# Altium project MiniPC.PrjPcb (part 3 of 17)

## Sheet DDR4_Arria10.SchDoc: DDR4
size B; DocumentNumber: 19; SheetNumber: 19; SheetTotal: 46
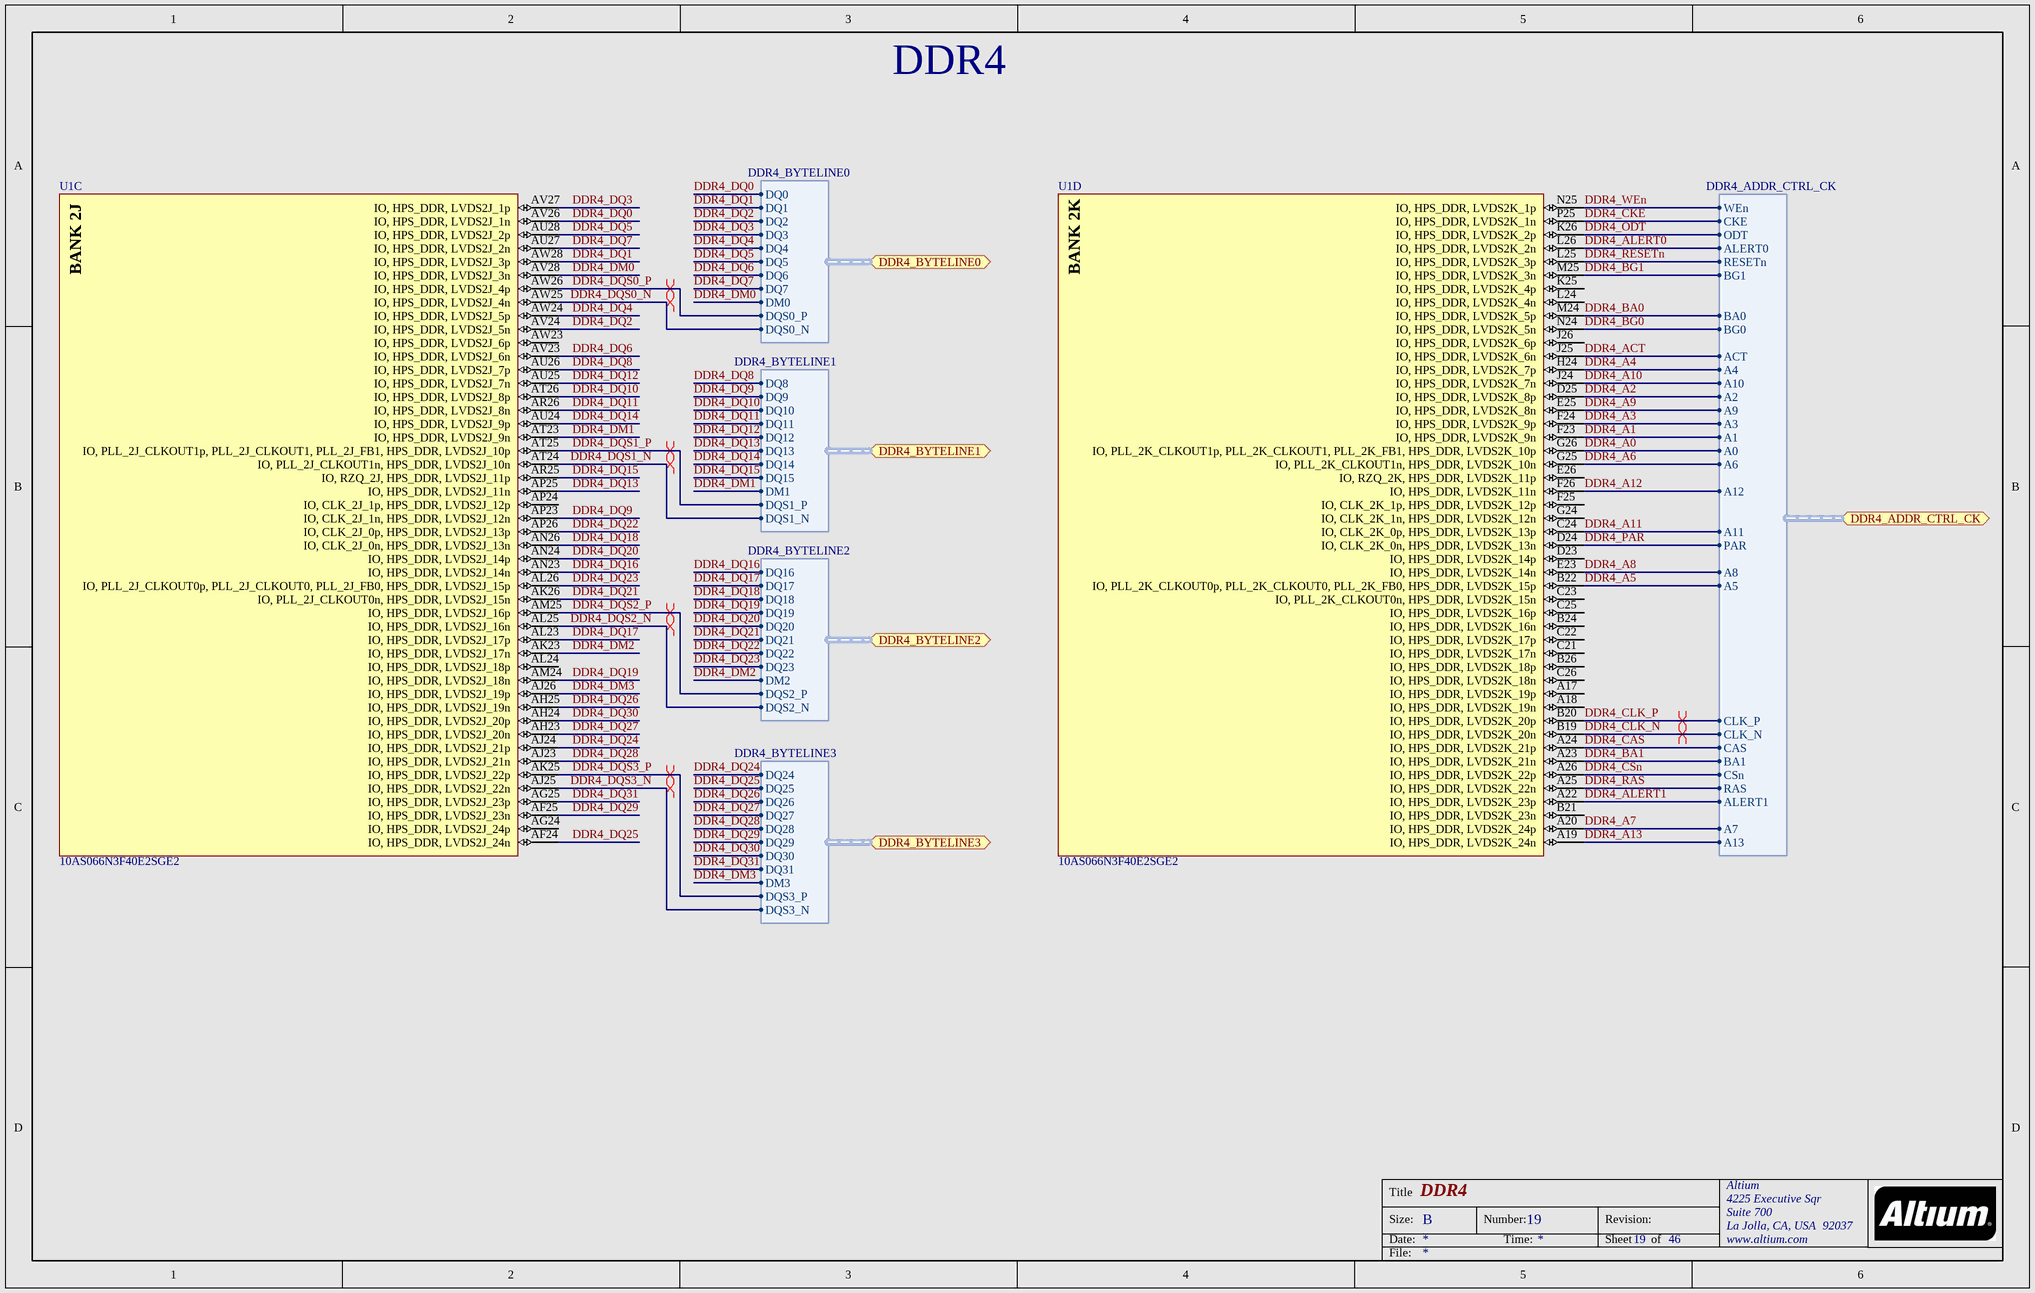
[diagram p9: DDR4_Arria10.SchDoc]

### Parts
U1  10AS066N3F40E2SGE2  [ALTR-FBGA1517_A-350]  (parts C,D of 31)

### Ports
DDR4_ADDR_CTRL_CK (harness DDR4_ADDR_CTRL_CK), DDR4_BYTELINE0 (harness DDR4_BYTELINE0), DDR4_BYTELINE1 (harness DDR4_BYTELINE1), DDR4_BYTELINE2 (harness DDR4_BYTELINE2), DDR4_BYTELINE3 (harness DDR4_BYTELINE3)

### Harnesses
DDR4_BYTELINE0: DQ0, DQ1, DQ2, DQ3, DQ4, DQ5, DQ6, DQ7, DM0, DQS0_P, DQS0_N
DDR4_BYTELINE1: DQ8, DQ9, DQ10, DQ11, DQ12, DQ13, DQ14, DQ15, DM1, DQS1_P, DQS1_N
DDR4_BYTELINE2: DQ16, DQ17, DQ18, DQ19, DQ20, DQ21, DQ22, DQ23, DM2, DQS2_P, DQS2_N
DDR4_BYTELINE3: DQ24, DQ25, DQ26, DQ27, DQ28, DQ29, DQ30, DQ31, DM3, DQS3_P, DQS3_N
DDR4_ADDR_CTRL_CK: A0, A1, A2, A3, A4, A5, A6, A7, A8, A9, A10, A11, A12, A13, BA0, BA1, BG0, CLK_P, CLK_N, CKE, WEn, CAS, RAS, CSn, PAR, ACT, ODT, ALERT0, RESETn, BG1, ALERT1

### Nets
DDR4_A0: U1.G26(IO,_PLL_2K_CLKOUT1p,_PLL_2K_CLKOUT1,_PLL_2K_FB1,_HPS_DDR,_LVDS2K_10p) ; port DDR4_ADDR_CTRL_CK.A0
DDR4_A1: U1.F23(IO,_HPS_DDR,_LVDS2K_9n) ; port DDR4_ADDR_CTRL_CK.A1
DDR4_A2: U1.D25(IO,_HPS_DDR,_LVDS2K_8p) ; port DDR4_ADDR_CTRL_CK.A2
DDR4_A3: U1.F24(IO,_HPS_DDR,_LVDS2K_9p) ; port DDR4_ADDR_CTRL_CK.A3
DDR4_A4: U1.H24(IO,_HPS_DDR,_LVDS2K_7p) ; port DDR4_ADDR_CTRL_CK.A4
DDR4_A5: U1.B22(IO,_PLL_2K_CLKOUT0p,_PLL_2K_CLKOUT0,_PLL_2K_FB0,_HPS_DDR,_LVDS2K_15p) ; port DDR4_ADDR_CTRL_CK.A5
DDR4_A6: U1.G25(IO,_PLL_2K_CLKOUT1n,_HPS_DDR,_LVDS2K_10n) ; port DDR4_ADDR_CTRL_CK.A6
DDR4_A7: U1.A20(IO,_HPS_DDR,_LVDS2K_24p) ; port DDR4_ADDR_CTRL_CK.A7
DDR4_A8: U1.E23(IO,_HPS_DDR,_LVDS2K_14n) ; port DDR4_ADDR_CTRL_CK.A8
DDR4_A9: U1.E25(IO,_HPS_DDR,_LVDS2K_8n) ; port DDR4_ADDR_CTRL_CK.A9
DDR4_A10: U1.J24(IO,_HPS_DDR,_LVDS2K_7n) ; port DDR4_ADDR_CTRL_CK.A10
DDR4_A11: U1.C24(IO,_CLK_2K_0p,_HPS_DDR,_LVDS2K_13p) ; port DDR4_ADDR_CTRL_CK.A11
DDR4_A12: U1.F26(IO,_HPS_DDR,_LVDS2K_11n) ; port DDR4_ADDR_CTRL_CK.A12
DDR4_A13: U1.A19(IO,_HPS_DDR,_LVDS2K_24n) ; port DDR4_ADDR_CTRL_CK.A13
DDR4_ACT: U1.J25(IO,_HPS_DDR,_LVDS2K_6n) ; port DDR4_ADDR_CTRL_CK.ACT
DDR4_ALERT0: U1.L26(IO,_HPS_DDR,_LVDS2K_2n) ; port DDR4_ADDR_CTRL_CK.ALERT0
DDR4_ALERT1: U1.A22(IO,_HPS_DDR,_LVDS2K_23p) ; port DDR4_ADDR_CTRL_CK.ALERT1
DDR4_BA0: U1.M24(IO,_HPS_DDR,_LVDS2K_5p) ; port DDR4_ADDR_CTRL_CK.BA0
DDR4_BA1: U1.A23(IO,_HPS_DDR,_LVDS2K_21n) ; port DDR4_ADDR_CTRL_CK.BA1
DDR4_BG0: U1.N24(IO,_HPS_DDR,_LVDS2K_5n) ; port DDR4_ADDR_CTRL_CK.BG0
DDR4_BG1: U1.M25(IO,_HPS_DDR,_LVDS2K_3n) ; port DDR4_ADDR_CTRL_CK.BG1
DDR4_CAS: U1.A24(IO,_HPS_DDR,_LVDS2K_21p) ; port DDR4_ADDR_CTRL_CK.CAS
DDR4_CKE: U1.P25(IO,_HPS_DDR,_LVDS2K_1n) ; port DDR4_ADDR_CTRL_CK.CKE
DDR4_CLK_N: U1.B19(IO,_HPS_DDR,_LVDS2K_20n) ; port DDR4_ADDR_CTRL_CK.CLK_N
DDR4_CLK_P: U1.B20(IO,_HPS_DDR,_LVDS2K_20p) ; port DDR4_ADDR_CTRL_CK.CLK_P
DDR4_CSn: U1.A26(IO,_HPS_DDR,_LVDS2K_22p) ; port DDR4_ADDR_CTRL_CK.CSn
DDR4_DM0: U1.AV28(IO,_HPS_DDR,_LVDS2J_3n) ; port DDR4_BYTELINE0.DM0
DDR4_DM1: U1.AT23(IO,_HPS_DDR,_LVDS2J_9n) ; port DDR4_BYTELINE1.DM1
DDR4_DM2: U1.AK23(IO,_HPS_DDR,_LVDS2J_17n) ; port DDR4_BYTELINE2.DM2
DDR4_DM3: U1.AJ26(IO,_HPS_DDR,_LVDS2J_19p) ; port DDR4_BYTELINE3.DM3
DDR4_DQ0: U1.AV26(IO,_HPS_DDR,_LVDS2J_1n) ; port DDR4_BYTELINE0.DQ0
DDR4_DQ1: U1.AW28(IO,_HPS_DDR,_LVDS2J_3p) ; port DDR4_BYTELINE0.DQ1
DDR4_DQ2: U1.AV24(IO,_HPS_DDR,_LVDS2J_5n) ; port DDR4_BYTELINE0.DQ2
DDR4_DQ3: U1.AV27(IO,_HPS_DDR,_LVDS2J_1p) ; port DDR4_BYTELINE0.DQ3
DDR4_DQ4: U1.AW24(IO,_HPS_DDR,_LVDS2J_5p) ; port DDR4_BYTELINE0.DQ4
DDR4_DQ5: U1.AU28(IO,_HPS_DDR,_LVDS2J_2p) ; port DDR4_BYTELINE0.DQ5
DDR4_DQ6: U1.AV23(IO,_HPS_DDR,_LVDS2J_6n) ; port DDR4_BYTELINE0.DQ6
DDR4_DQ7: U1.AU27(IO,_HPS_DDR,_LVDS2J_2n) ; port DDR4_BYTELINE0.DQ7
DDR4_DQ8: U1.AU26(IO,_HPS_DDR,_LVDS2J_7p) ; port DDR4_BYTELINE1.DQ8
DDR4_DQ9: U1.AP23(IO,_CLK_2J_1n,_HPS_DDR,_LVDS2J_12n) ; port DDR4_BYTELINE1.DQ9
DDR4_DQ10: U1.AT26(IO,_HPS_DDR,_LVDS2J_8p) ; port DDR4_BYTELINE1.DQ10
DDR4_DQ11: U1.AR26(IO,_HPS_DDR,_LVDS2J_8n) ; port DDR4_BYTELINE1.DQ11
DDR4_DQ12: U1.AU25(IO,_HPS_DDR,_LVDS2J_7n) ; port DDR4_BYTELINE1.DQ12
DDR4_DQ13: U1.AP25(IO,_HPS_DDR,_LVDS2J_11n) ; port DDR4_BYTELINE1.DQ13
DDR4_DQ14: U1.AU24(IO,_HPS_DDR,_LVDS2J_9p) ; port DDR4_BYTELINE1.DQ14
DDR4_DQ15: U1.AR25(IO,_RZQ_2J,_HPS_DDR,_LVDS2J_11p) ; port DDR4_BYTELINE1.DQ15
DDR4_DQ16: U1.AN23(IO,_HPS_DDR,_LVDS2J_14n) ; port DDR4_BYTELINE2.DQ16
DDR4_DQ17: U1.AL23(IO,_HPS_DDR,_LVDS2J_17p) ; port DDR4_BYTELINE2.DQ17
DDR4_DQ18: U1.AN26(IO,_CLK_2J_0n,_HPS_DDR,_LVDS2J_13n) ; port DDR4_BYTELINE2.DQ18
DDR4_DQ19: U1.AM24(IO,_HPS_DDR,_LVDS2J_18n) ; port DDR4_BYTELINE2.DQ19
DDR4_DQ20: U1.AN24(IO,_HPS_DDR,_LVDS2J_14p) ; port DDR4_BYTELINE2.DQ20
DDR4_DQ21: U1.AK26(IO,_PLL_2J_CLKOUT0n,_HPS_DDR,_LVDS2J_15n) ; port DDR4_BYTELINE2.DQ21
DDR4_DQ22: U1.AP26(IO,_CLK_2J_0p,_HPS_DDR,_LVDS2J_13p) ; port DDR4_BYTELINE2.DQ22
DDR4_DQ23: U1.AL26(IO,_PLL_2J_CLKOUT0p,_PLL_2J_CLKOUT0,_PLL_2J_FB0,_HPS_DDR,_LVDS2J_15p) ; port DDR4_BYTELINE2.DQ23
DDR4_DQ24: U1.AJ24(IO,_HPS_DDR,_LVDS2J_21p) ; port DDR4_BYTELINE3.DQ24
DDR4_DQ25: U1.AF24(IO,_HPS_DDR,_LVDS2J_24n) ; port DDR4_BYTELINE3.DQ25
DDR4_DQ26: U1.AH25(IO,_HPS_DDR,_LVDS2J_19n) ; port DDR4_BYTELINE3.DQ26
DDR4_DQ27: U1.AH23(IO,_HPS_DDR,_LVDS2J_20n) ; port DDR4_BYTELINE3.DQ27
DDR4_DQ28: U1.AJ23(IO,_HPS_DDR,_LVDS2J_21n) ; port DDR4_BYTELINE3.DQ28
DDR4_DQ29: U1.AF25(IO,_HPS_DDR,_LVDS2J_23n) ; port DDR4_BYTELINE3.DQ29
DDR4_DQ30: U1.AH24(IO,_HPS_DDR,_LVDS2J_20p) ; port DDR4_BYTELINE3.DQ30
DDR4_DQ31: U1.AG25(IO,_HPS_DDR,_LVDS2J_23p) ; port DDR4_BYTELINE3.DQ31
DDR4_DQS0_N: U1.AW25(IO,_HPS_DDR,_LVDS2J_4n) ; port DDR4_BYTELINE0.DQS0_N
DDR4_DQS0_P: U1.AW26(IO,_HPS_DDR,_LVDS2J_4p) ; port DDR4_BYTELINE0.DQS0_P
DDR4_DQS1_N: U1.AT24(IO,_PLL_2J_CLKOUT1n,_HPS_DDR,_LVDS2J_10n) ; port DDR4_BYTELINE1.DQS1_N
DDR4_DQS1_P: U1.AT25(IO,_PLL_2J_CLKOUT1p,_PLL_2J_CLKOUT1,_PLL_2J_FB1,_HPS_DDR,_LVDS2J_10p) ; port DDR4_BYTELINE1.DQS1_P
DDR4_DQS2_N: U1.AL25(IO,_HPS_DDR,_LVDS2J_16n) ; port DDR4_BYTELINE2.DQS2_N
DDR4_DQS2_P: U1.AM25(IO,_HPS_DDR,_LVDS2J_16p) ; port DDR4_BYTELINE2.DQS2_P
DDR4_DQS3_N: U1.AJ25(IO,_HPS_DDR,_LVDS2J_22n) ; port DDR4_BYTELINE3.DQS3_N
DDR4_DQS3_P: U1.AK25(IO,_HPS_DDR,_LVDS2J_22p) ; port DDR4_BYTELINE3.DQS3_P
DDR4_ODT: U1.K26(IO,_HPS_DDR,_LVDS2K_2p) ; port DDR4_ADDR_CTRL_CK.ODT
DDR4_PAR: U1.D24(IO,_CLK_2K_0n,_HPS_DDR,_LVDS2K_13n) ; port DDR4_ADDR_CTRL_CK.PAR
DDR4_RAS: U1.A25(IO,_HPS_DDR,_LVDS2K_22n) ; port DDR4_ADDR_CTRL_CK.RAS
DDR4_RESETn: U1.L25(IO,_HPS_DDR,_LVDS2K_3p) ; port DDR4_ADDR_CTRL_CK.RESETn
DDR4_WEn: U1.N25(IO,_HPS_DDR,_LVDS2K_1p) ; port DDR4_ADDR_CTRL_CK.WEn

Not connected (* = marked no-connect by the designer): U1 A17(IO,_HPS_DDR,_LVDS2K_19p) A18(IO,_HPS_DDR,_LVDS2K_19n) AG24(IO,_HPS_DDR,_LVDS2J_24p) AL24(IO,_HPS_DDR,_LVDS2J_18p) AP24(IO,_CLK_2J_1p,_HPS_DDR,_LVDS2J_12p) AW23(IO,_HPS_DDR,_LVDS2J_6p) B21(IO,_HPS_DDR,_LVDS2K_23n) B24(IO,_HPS_DDR,_LVDS2K_16n) B26(IO,_HPS_DDR,_LVDS2K_18p) C21(IO,_HPS_DDR,_LVDS2K_17n) C22(IO,_HPS_DDR,_LVDS2K_17p) C23(IO,_PLL_2K_CLKOUT0n,_HPS_DDR,_LVDS2K_15n) C25(IO,_HPS_DDR,_LVDS2K_16p) C26(IO,_HPS_DDR,_LVDS2K_18n) D23(IO,_HPS_DDR,_LVDS2K_14p) E26(IO,_RZQ_2K,_HPS_DDR,_LVDS2K_11p) F25(IO,_CLK_2K_1p,_HPS_DDR,_LVDS2K_12p) G24(IO,_CLK_2K_1n,_HPS_DDR,_LVDS2K_12n) J26(IO,_HPS_DDR,_LVDS2K_6p) K25(IO,_HPS_DDR,_LVDS2K_4p) L24(IO,_HPS_DDR,_LVDS2K_4n)

### Layout directives
differential pair: DDR4_CLK_N, DDR4_CLK_P, DDR4_DQS0_N, DDR4_DQS0_P, DDR4_DQS1_N, DDR4_DQS1_P, DDR4_DQS2_N, DDR4_DQS2_P, DDR4_DQS3_N, DDR4_DQS3_P

### Notes on the sheet
- Title
- Size:
- Date:
- B
- Number:
- Time:
- Revision:
- Sheet
- of
- File:
- (in symbol CMP-1689-00006-3, part C) BANK 2J
- (in symbol CMP-1689-00006-3, part D) BANK 2K

### Library data of the parts
U1 = CMP-1689-00006-3: Arria 10 SX Family, 588 I/O Pins, 16 Fractional PLLs, 1517-Pin FBGA, Speed Grade 2, Extended Grade, RoHS; ComponentLink3Description: Package Specification; PackageVersion: Rev. 5.0, 01/2016; ComponentLink3URL: https://www.altera.com/content/dam/altera-www/global/en_US/pdfs/literature/packaging/04r00461-04.pdf; ComponentLink2Description: Datasheet; Code_JEDEC: MS-034; Mounting Technology: Surface Mount; PartNumber: 10AS066N3F40E2SGE2; PackageDescription: 1517-Pin FineLine Ball-Grid Array (FBGA), Body 40 x 40 mm, Pitch 1 mm; ComponentLink2URL: https://www.altera.com/content/dam/altera-www/global/en_US/pdfs/literature/hb/arria-10/a10_datasheet.pdf; ComponentLink1URL: https://www.altera.com/; DatasheetVersion: Rev. 2016-06-24, 06/2016; ComponentLink1Description: Manufacturer URL

## Sheet DDR4_SODIMM1_Arria10.SchDoc: DDR4 SODIMM Arria10
size B; DocumentNumber: 21; SheetNumber: 21; SheetTotal: 46
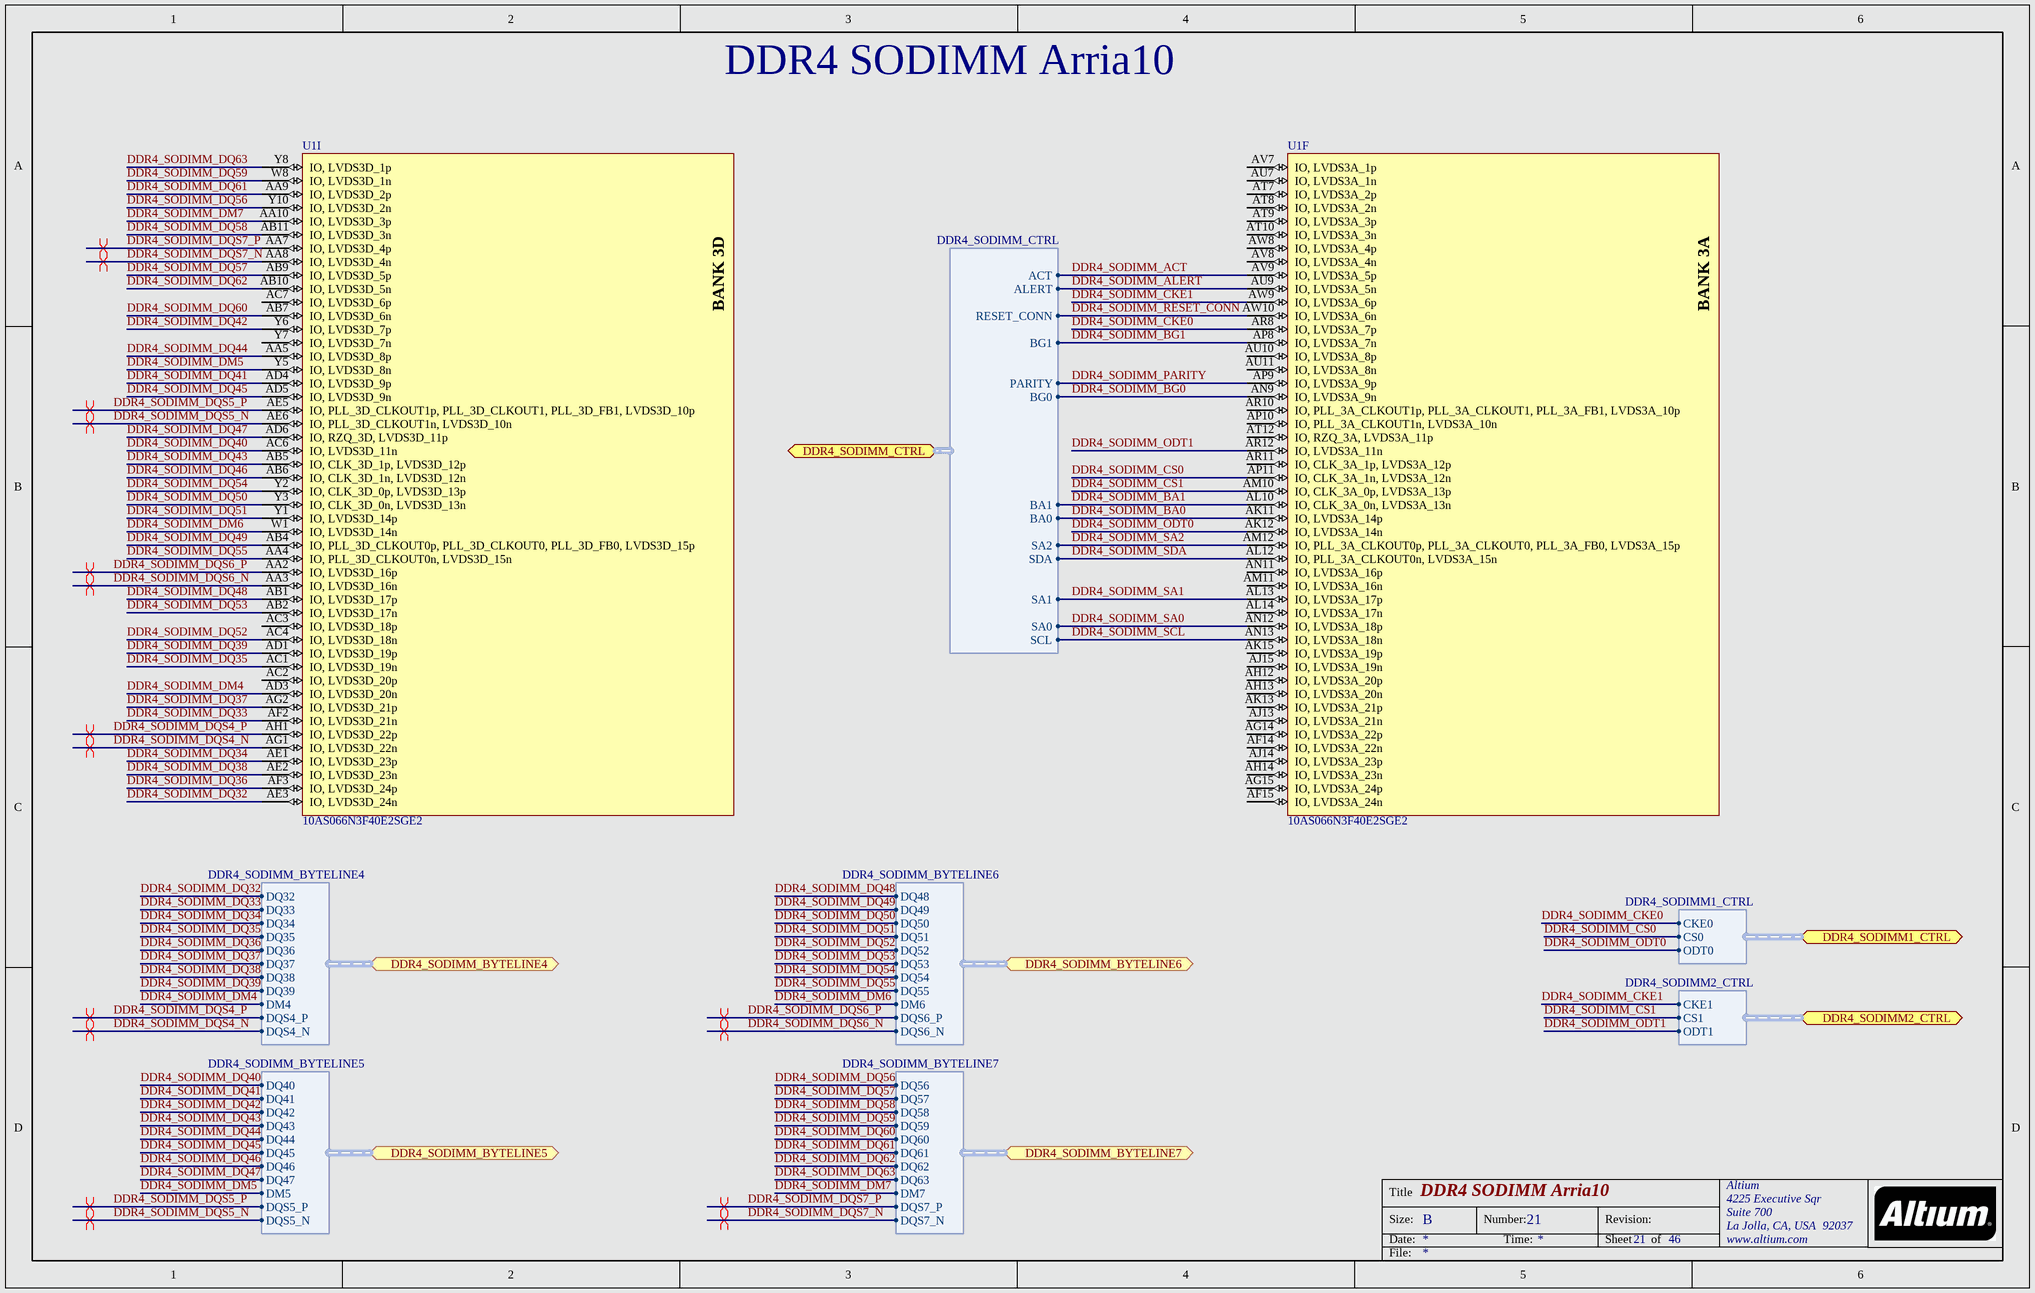
[diagram p10: DDR4_SODIMM1_Arria10.SchDoc]

### Parts
U1  10AS066N3F40E2SGE2  [ALTR-FBGA1517_A-350]  (parts F,I of 31)

### Ports
DDR4_SODIMM1_CTRL (harness DDR4_SODIMM1_CTRL), DDR4_SODIMM2_CTRL (harness DDR4_SODIMM2_CTRL), DDR4_SODIMM_BYTELINE4 (harness DDR4_SODIMM_BYTELINE4), DDR4_SODIMM_BYTELINE5 (harness DDR4_SODIMM_BYTELINE5), DDR4_SODIMM_BYTELINE6 (harness DDR4_SODIMM_BYTELINE6), DDR4_SODIMM_BYTELINE7 (harness DDR4_SODIMM_BYTELINE7), DDR4_SODIMM_CTRL (harness DDR4_SODIMM_CTRL)

### Harnesses
DDR4_SODIMM_BYTELINE4: DQ32, DQ33, DQ34, DQ35, DQ36, DQ37, DQ38, DQ39, DM4, DQS4_P, DQS4_N
DDR4_SODIMM_BYTELINE5: DQ40, DQ41, DQ42, DQ43, DQ44, DQ45, DQ46, DQ47, DM5, DQS5_P, DQS5_N
DDR4_SODIMM_BYTELINE6: DQ48, DQ49, DQ50, DQ51, DQ52, DQ53, DQ54, DQ55, DM6, DQS6_P, DQS6_N
DDR4_SODIMM_BYTELINE7: DQ56, DQ57, DQ58, DQ59, DQ60, DQ61, DQ62, DQ63, DM7, DQS7_P, DQS7_N
DDR4_SODIMM1_CTRL: CKE0, CS0, ODT0
DDR4_SODIMM2_CTRL: CKE1, CS1, ODT1
DDR4_SODIMM_CTRL: SA0, SA1, SA2, BA0, BA1, BG0, BG1, SCL, SDA, RESET_CONN, ACT, ALERT, PARITY

### Nets
DDR4_SODIMM_ACT: U1.AV9(IO,_LVDS3A_5p) ; port DDR4_SODIMM_CTRL.ACT
DDR4_SODIMM_ALERT: U1.AU9(IO,_LVDS3A_5n) ; port DDR4_SODIMM_CTRL.ALERT
DDR4_SODIMM_BA0: U1.AK11(IO,_LVDS3A_14p) ; port DDR4_SODIMM_CTRL.BA0
DDR4_SODIMM_BA1: U1.AL10(IO,_CLK_3A_0n,_LVDS3A_13n) ; port DDR4_SODIMM_CTRL.BA1
DDR4_SODIMM_BG0: U1.AN9(IO,_LVDS3A_9n) ; port DDR4_SODIMM_CTRL.BG0
DDR4_SODIMM_BG1: U1.AP8(IO,_LVDS3A_7n) ; port DDR4_SODIMM_CTRL.BG1
DDR4_SODIMM_CKE0: U1.AR8(IO,_LVDS3A_7p) ; port DDR4_SODIMM1_CTRL.CKE0
DDR4_SODIMM_CKE1: U1.AW9(IO,_LVDS3A_6p) ; port DDR4_SODIMM2_CTRL.CKE1
DDR4_SODIMM_CS0: U1.AP11(IO,_CLK_3A_1n,_LVDS3A_12n) ; port DDR4_SODIMM1_CTRL.CS0
DDR4_SODIMM_CS1: U1.AM10(IO,_CLK_3A_0p,_LVDS3A_13p) ; port DDR4_SODIMM2_CTRL.CS1
DDR4_SODIMM_DM4: U1.AD3(IO,_LVDS3D_20n) ; port DDR4_SODIMM_BYTELINE4.DM4
DDR4_SODIMM_DM5: U1.Y5(IO,_LVDS3D_8n) ; port DDR4_SODIMM_BYTELINE5.DM5
DDR4_SODIMM_DM6: U1.W1(IO,_LVDS3D_14n) ; port DDR4_SODIMM_BYTELINE6.DM6
DDR4_SODIMM_DM7: U1.AA10(IO,_LVDS3D_3p) ; port DDR4_SODIMM_BYTELINE7.DM7
DDR4_SODIMM_DQ32: U1.AE3(IO,_LVDS3D_24n) ; port DDR4_SODIMM_BYTELINE4.DQ32
DDR4_SODIMM_DQ33: U1.AF2(IO,_LVDS3D_21n) ; port DDR4_SODIMM_BYTELINE4.DQ33
DDR4_SODIMM_DQ34: U1.AE1(IO,_LVDS3D_23p) ; port DDR4_SODIMM_BYTELINE4.DQ34
DDR4_SODIMM_DQ35: U1.AC1(IO,_LVDS3D_19n) ; port DDR4_SODIMM_BYTELINE4.DQ35
DDR4_SODIMM_DQ36: U1.AF3(IO,_LVDS3D_24p) ; port DDR4_SODIMM_BYTELINE4.DQ36
DDR4_SODIMM_DQ37: U1.AG2(IO,_LVDS3D_21p) ; port DDR4_SODIMM_BYTELINE4.DQ37
DDR4_SODIMM_DQ38: U1.AE2(IO,_LVDS3D_23n) ; port DDR4_SODIMM_BYTELINE4.DQ38
DDR4_SODIMM_DQ39: U1.AD1(IO,_LVDS3D_19p) ; port DDR4_SODIMM_BYTELINE4.DQ39
DDR4_SODIMM_DQ40: U1.AC6(IO,_LVDS3D_11n) ; port DDR4_SODIMM_BYTELINE5.DQ40
DDR4_SODIMM_DQ41: U1.AD4(IO,_LVDS3D_9p) ; port DDR4_SODIMM_BYTELINE5.DQ41
DDR4_SODIMM_DQ42: U1.Y6(IO,_LVDS3D_7p) ; port DDR4_SODIMM_BYTELINE5.DQ42
DDR4_SODIMM_DQ43: U1.AB5(IO,_CLK_3D_1p,_LVDS3D_12p) ; port DDR4_SODIMM_BYTELINE5.DQ43
DDR4_SODIMM_DQ44: U1.AA5(IO,_LVDS3D_8p) ; port DDR4_SODIMM_BYTELINE5.DQ44
DDR4_SODIMM_DQ45: U1.AD5(IO,_LVDS3D_9n) ; port DDR4_SODIMM_BYTELINE5.DQ45
DDR4_SODIMM_DQ46: U1.AB6(IO,_CLK_3D_1n,_LVDS3D_12n) ; port DDR4_SODIMM_BYTELINE5.DQ46
DDR4_SODIMM_DQ47: U1.AD6(IO,_RZQ_3D,_LVDS3D_11p) ; port DDR4_SODIMM_BYTELINE5.DQ47
DDR4_SODIMM_DQ48: U1.AB1(IO,_LVDS3D_17p) ; port DDR4_SODIMM_BYTELINE6.DQ48
DDR4_SODIMM_DQ49: U1.AB4(IO,_PLL_3D_CLKOUT0p,_PLL_3D_CLKOUT0,_PLL_3D_FB0,_LVDS3D_15p) ; port DDR4_SODIMM_BYTELINE6.DQ49
DDR4_SODIMM_DQ50: U1.Y3(IO,_CLK_3D_0n,_LVDS3D_13n) ; port DDR4_SODIMM_BYTELINE6.DQ50
DDR4_SODIMM_DQ51: U1.Y1(IO,_LVDS3D_14p) ; port DDR4_SODIMM_BYTELINE6.DQ51
DDR4_SODIMM_DQ52: U1.AC4(IO,_LVDS3D_18n) ; port DDR4_SODIMM_BYTELINE6.DQ52
DDR4_SODIMM_DQ53: U1.AB2(IO,_LVDS3D_17n) ; port DDR4_SODIMM_BYTELINE6.DQ53
DDR4_SODIMM_DQ54: U1.Y2(IO,_CLK_3D_0p,_LVDS3D_13p) ; port DDR4_SODIMM_BYTELINE6.DQ54
DDR4_SODIMM_DQ55: U1.AA4(IO,_PLL_3D_CLKOUT0n,_LVDS3D_15n) ; port DDR4_SODIMM_BYTELINE6.DQ55
DDR4_SODIMM_DQ56: U1.Y10(IO,_LVDS3D_2n) ; port DDR4_SODIMM_BYTELINE7.DQ56
DDR4_SODIMM_DQ57: U1.AB9(IO,_LVDS3D_5p) ; port DDR4_SODIMM_BYTELINE7.DQ57
DDR4_SODIMM_DQ58: U1.AB11(IO,_LVDS3D_3n) ; port DDR4_SODIMM_BYTELINE7.DQ58
DDR4_SODIMM_DQ59: U1.W8(IO,_LVDS3D_1n) ; port DDR4_SODIMM_BYTELINE7.DQ59
DDR4_SODIMM_DQ60: U1.AB7(IO,_LVDS3D_6n) ; port DDR4_SODIMM_BYTELINE7.DQ60
DDR4_SODIMM_DQ61: U1.AA9(IO,_LVDS3D_2p) ; port DDR4_SODIMM_BYTELINE7.DQ61
DDR4_SODIMM_DQ62: U1.AB10(IO,_LVDS3D_5n) ; port DDR4_SODIMM_BYTELINE7.DQ62
DDR4_SODIMM_DQ63: U1.Y8(IO,_LVDS3D_1p) ; port DDR4_SODIMM_BYTELINE7.DQ63
DDR4_SODIMM_DQS4_N: U1.AG1(IO,_LVDS3D_22n) ; port DDR4_SODIMM_BYTELINE4.DQS4_N
DDR4_SODIMM_DQS4_P: U1.AH1(IO,_LVDS3D_22p) ; port DDR4_SODIMM_BYTELINE4.DQS4_P
DDR4_SODIMM_DQS5_N: U1.AE6(IO,_PLL_3D_CLKOUT1n,_LVDS3D_10n) ; port DDR4_SODIMM_BYTELINE5.DQS5_N
DDR4_SODIMM_DQS5_P: U1.AE5(IO,_PLL_3D_CLKOUT1p,_PLL_3D_CLKOUT1,_PLL_3D_FB1,_LVDS3D_10p) ; port DDR4_SODIMM_BYTELINE5.DQS5_P
DDR4_SODIMM_DQS6_N: U1.AA3(IO,_LVDS3D_16n) ; port DDR4_SODIMM_BYTELINE6.DQS6_N
DDR4_SODIMM_DQS6_P: U1.AA2(IO,_LVDS3D_16p) ; port DDR4_SODIMM_BYTELINE6.DQS6_P
DDR4_SODIMM_DQS7_N: U1.AA8(IO,_LVDS3D_4n) ; port DDR4_SODIMM_BYTELINE7.DQS7_N
DDR4_SODIMM_DQS7_P: U1.AA7(IO,_LVDS3D_4p) ; port DDR4_SODIMM_BYTELINE7.DQS7_P
DDR4_SODIMM_ODT0: U1.AK12(IO,_LVDS3A_14n) ; port DDR4_SODIMM1_CTRL.ODT0
DDR4_SODIMM_ODT1: U1.AR12(IO,_LVDS3A_11n) ; port DDR4_SODIMM2_CTRL.ODT1
DDR4_SODIMM_PARITY: U1.AP9(IO,_LVDS3A_9p) ; port DDR4_SODIMM_CTRL.PARITY
DDR4_SODIMM_RESET_CONN: U1.AW10(IO,_LVDS3A_6n) ; port DDR4_SODIMM_CTRL.RESET_CONN
DDR4_SODIMM_SA0: U1.AN12(IO,_LVDS3A_18p) ; port DDR4_SODIMM_CTRL.SA0
DDR4_SODIMM_SA1: U1.AL13(IO,_LVDS3A_17p) ; port DDR4_SODIMM_CTRL.SA1
DDR4_SODIMM_SA2: U1.AM12(IO,_PLL_3A_CLKOUT0p,_PLL_3A_CLKOUT0,_PLL_3A_FB0,_LVDS3A_15p) ; port DDR4_SODIMM_CTRL.SA2
DDR4_SODIMM_SCL: U1.AN13(IO,_LVDS3A_18n) ; port DDR4_SODIMM_CTRL.SCL
DDR4_SODIMM_SDA: U1.AL12(IO,_PLL_3A_CLKOUT0n,_LVDS3A_15n) ; port DDR4_SODIMM_CTRL.SDA

Not connected (* = marked no-connect by the designer): U1 AC2(IO,_LVDS3D_20p) AC3(IO,_LVDS3D_18p) AC7(IO,_LVDS3D_6p) AF14(IO,_LVDS3A_22n) AF15(IO,_LVDS3A_24n) AG14(IO,_LVDS3A_22p) AG15(IO,_LVDS3A_24p) AH12(IO,_LVDS3A_20p) AH13(IO,_LVDS3A_20n) AH14(IO,_LVDS3A_23n) AJ13(IO,_LVDS3A_21n) AJ14(IO,_LVDS3A_23p) AJ15(IO,_LVDS3A_19n) AK13(IO,_LVDS3A_21p) AK15(IO,_LVDS3A_19p) AL14(IO,_LVDS3A_17n) AM11(IO,_LVDS3A_16n) AN11(IO,_LVDS3A_16p) AP10(IO,_PLL_3A_CLKOUT1n,_LVDS3A_10n) AR10(IO,_PLL_3A_CLKOUT1p,_PLL_3A_CLKOUT1,_PLL_3A_FB1,_LVDS3A_10p) AR11(IO,_CLK_3A_1p,_LVDS3A_12p) AT7(IO,_LVDS3A_2p) AT8(IO,_LVDS3A_2n) AT9(IO,_LVDS3A_3p) AT10(IO,_LVDS3A_3n) AT12(IO,_RZQ_3A,_LVDS3A_11p) AU7(IO,_LVDS3A_1n) AU10(IO,_LVDS3A_8p) AU11(IO,_LVDS3A_8n) AV7(IO,_LVDS3A_1p) AV8(IO,_LVDS3A_4n) AW8(IO,_LVDS3A_4p) Y7(IO,_LVDS3D_7n)

### Layout directives
differential pair: DDR4_SODIMM_DQS4_N, DDR4_SODIMM_DQS4_P, DDR4_SODIMM_DQS5_N, DDR4_SODIMM_DQS5_P, DDR4_SODIMM_DQS6_N, DDR4_SODIMM_DQS6_P, DDR4_SODIMM_DQS7_N, DDR4_SODIMM_DQS7_P

### Notes on the sheet
- Title
- Size:
- Date:
- B
- Number:
- Time:
- Revision:
- Sheet
- of
- File:
- (in symbol CMP-1689-00006-3, part F) BANK 3A
- (in symbol CMP-1689-00006-3, part I) BANK 3D

### Library data of the parts
U1 = CMP-1689-00006-3: as U1 on sheet DDR4_Arria10; ComponentLink3Description: Package Specification; PackageVersion: Rev. 5.0, 01/2016; ComponentLink3URL: https://www.altera.com/content/dam/altera-www/global/en_US/pdfs/literature/packaging/04r00461-04.pdf; ComponentLink2Description: Datasheet; Code_JEDEC: MS-034; Mounting Technology: Surface Mount; PartNumber: 10AS066N3F40E2SGE2; PackageDescription: 1517-Pin FineLine Ball-Grid Array (FBGA), Body 40 x 40 mm, Pitch 1 mm; ComponentLink2URL: https://www.altera.com/content/dam/altera-www/global/en_US/pdfs/literature/hb/arria-10/a10_datasheet.pdf; ComponentLink1URL: https://www.altera.com/; DatasheetVersion: Rev. 2016-06-24, 06/2016; ComponentLink1Description: Manufacturer URL

## Sheet DDR4_SODIMM_Arria10.SchDoc: DDR4 SODIMM Arria10
size B; DocumentNumber: 20; SheetNumber: 20; SheetTotal: 46
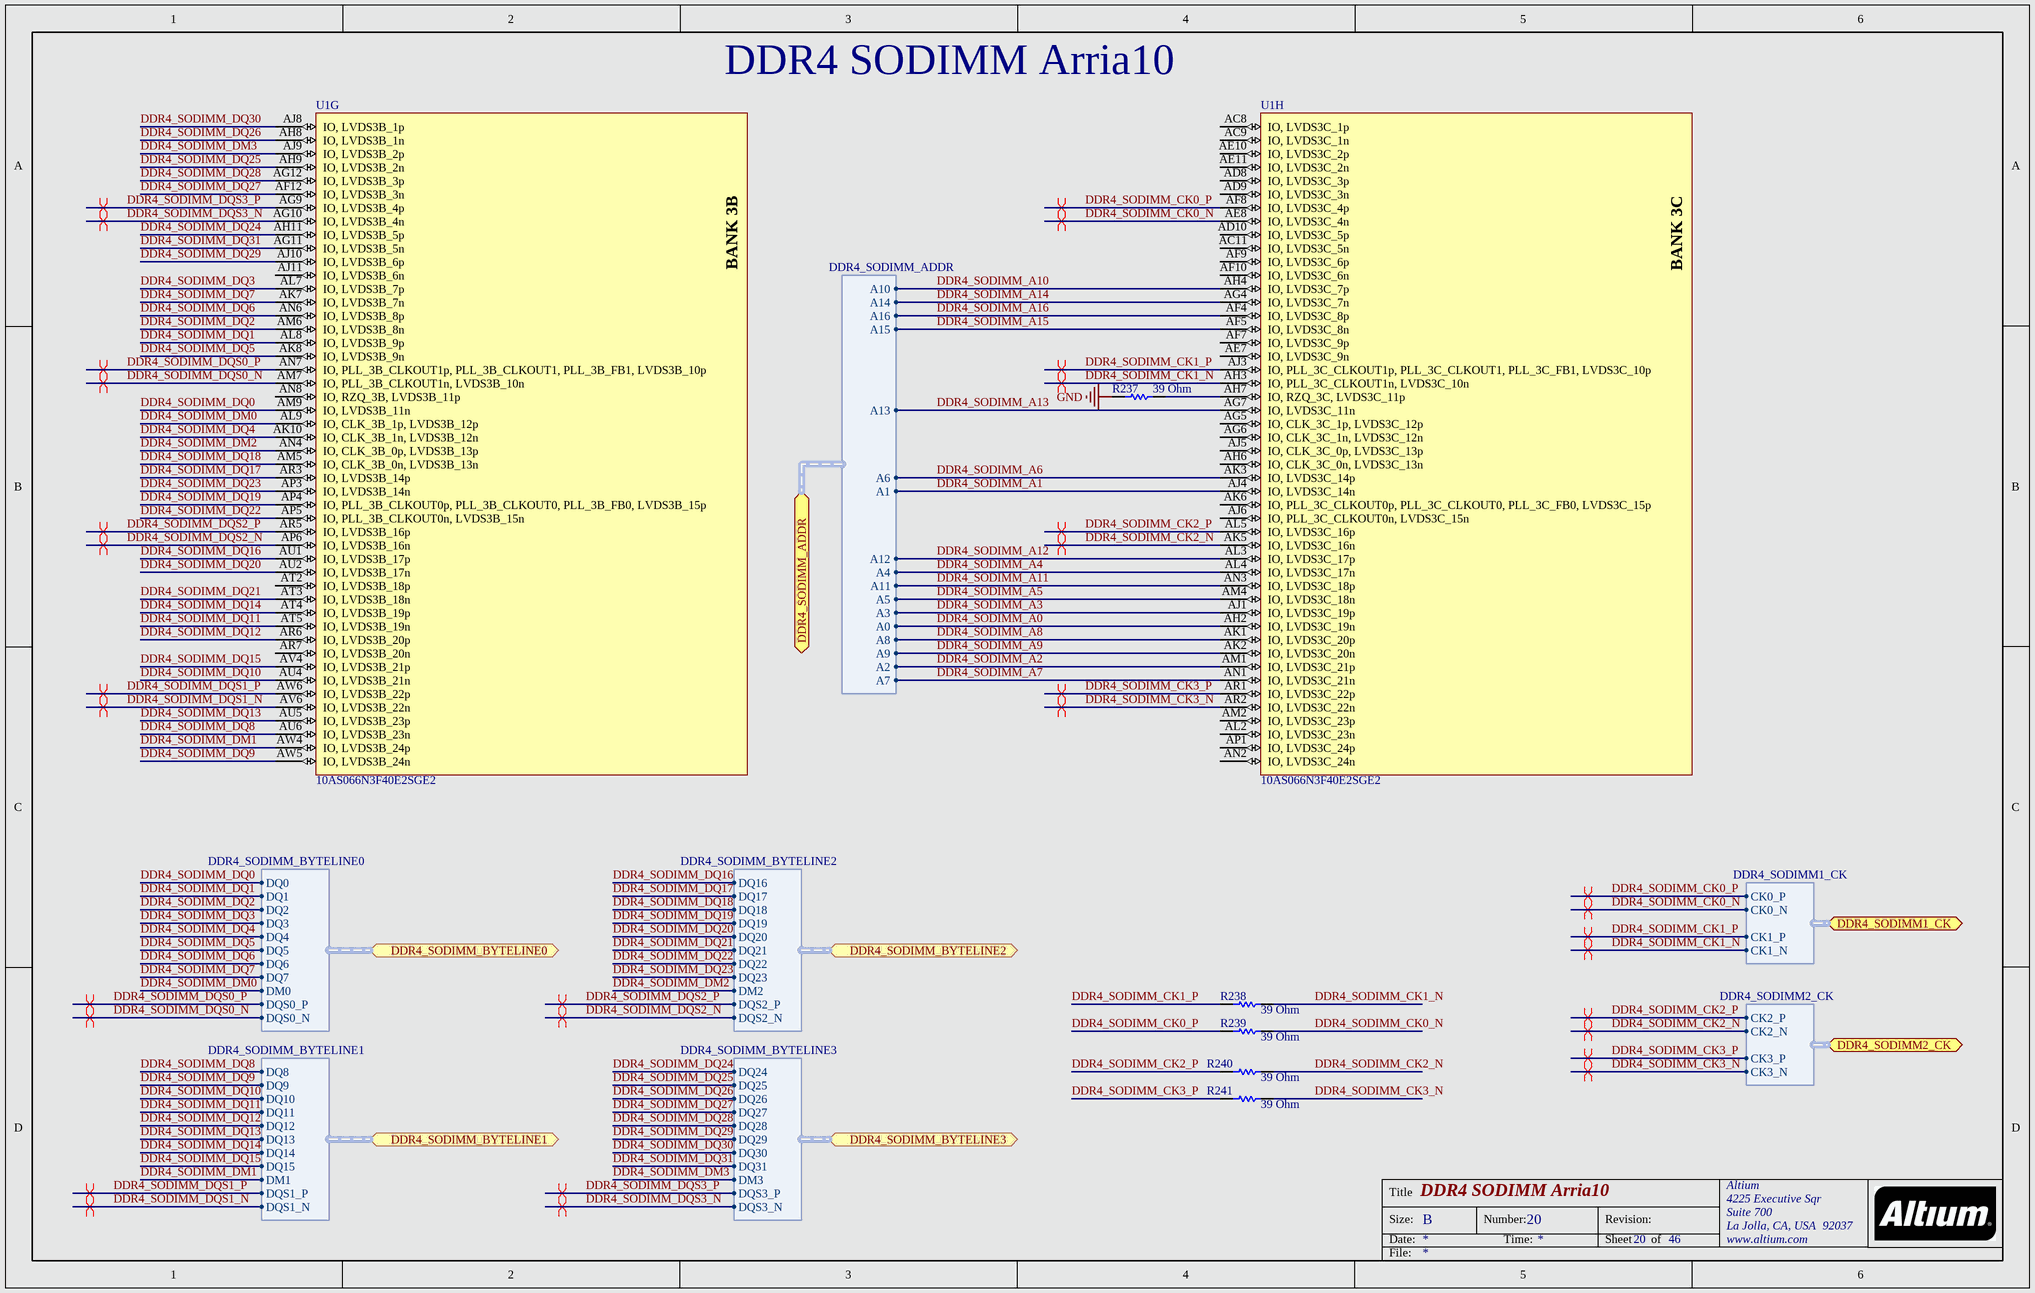
[diagram p11: DDR4_SODIMM_Arria10.SchDoc]

### Parts
R237  Resistance: 39 Ohm  [RESC1005X40X25NL5T10]  (hidden comment: RC0402JR-0739RL)
R238  Resistance: 39 Ohm  [RESC1005X40X25NL5T10]  (hidden comment: RC0402JR-0739RL)
R239  Resistance: 39 Ohm  [RESC1005X40X25NL5T10]  (hidden comment: RC0402JR-0739RL)
R240  Resistance: 39 Ohm  [RESC1005X40X25NL5T10]  (hidden comment: RC0402JR-0739RL)
R241  Resistance: 39 Ohm  [RESC1005X40X25NL5T10]  (hidden comment: RC0402JR-0739RL)
U1  10AS066N3F40E2SGE2  [ALTR-FBGA1517_A-350]  (parts G,H of 31)

### Ports
DDR4_SODIMM1_CK (harness DDR4_SODIMM1_CK), DDR4_SODIMM2_CK (harness DDR4_SODIMM2_CK), DDR4_SODIMM_ADDR (harness DDR4_SODIMM_ADDR), DDR4_SODIMM_BYTELINE0 (harness DDR4_SODIMM_BYTELINE0), DDR4_SODIMM_BYTELINE1 (harness DDR4_SODIMM_BYTELINE1), DDR4_SODIMM_BYTELINE2 (harness DDR4_SODIMM_BYTELINE2), DDR4_SODIMM_BYTELINE3 (harness DDR4_SODIMM_BYTELINE3)

### Harnesses
DDR4_SODIMM_ADDR: A10, A14, A16, A15, A13, A3, A0, A6, A1, A8, A9, A2, A7, A12, A4, A11, A5
DDR4_SODIMM1_CK: CK0_N, CK0_P, CK1_P, CK1_N
DDR4_SODIMM2_CK: CK2_N, CK2_P, CK3_P, CK3_N
DDR4_SODIMM_BYTELINE0: DQ0, DQ1, DQ2, DQ3, DQ4, DQ5, DQ6, DQ7, DM0, DQS0_P, DQS0_N
DDR4_SODIMM_BYTELINE1: DQ8, DQ9, DQ10, DQ11, DQ12, DQ13, DQ14, DQ15, DM1, DQS1_P, DQS1_N
DDR4_SODIMM_BYTELINE2: DQ16, DQ17, DQ18, DQ19, DQ20, DQ21, DQ22, DQ23, DM2, DQS2_P, DQS2_N
DDR4_SODIMM_BYTELINE3: DQ24, DQ25, DQ26, DQ27, DQ28, DQ29, DQ30, DQ31, DM3, DQS3_P, DQS3_N

### Nets
GND: R237.1
DDR4_SODIMM_A0: U1.AH2(IO,_LVDS3C_19n) ; port DDR4_SODIMM_ADDR.A0
DDR4_SODIMM_A1: U1.AJ4(IO,_LVDS3C_14n) ; port DDR4_SODIMM_ADDR.A1
DDR4_SODIMM_A2: U1.AM1(IO,_LVDS3C_21p) ; port DDR4_SODIMM_ADDR.A2
DDR4_SODIMM_A3: U1.AJ1(IO,_LVDS3C_19p) ; port DDR4_SODIMM_ADDR.A3
DDR4_SODIMM_A4: U1.AL4(IO,_LVDS3C_17n) ; port DDR4_SODIMM_ADDR.A4
DDR4_SODIMM_A5: U1.AM4(IO,_LVDS3C_18n) ; port DDR4_SODIMM_ADDR.A5
DDR4_SODIMM_A6: U1.AK3(IO,_LVDS3C_14p) ; port DDR4_SODIMM_ADDR.A6
DDR4_SODIMM_A7: U1.AN1(IO,_LVDS3C_21n) ; port DDR4_SODIMM_ADDR.A7
DDR4_SODIMM_A8: U1.AK1(IO,_LVDS3C_20p) ; port DDR4_SODIMM_ADDR.A8
DDR4_SODIMM_A9: U1.AK2(IO,_LVDS3C_20n) ; port DDR4_SODIMM_ADDR.A9
DDR4_SODIMM_A10: U1.AH4(IO,_LVDS3C_7p) ; port DDR4_SODIMM_ADDR.A10
DDR4_SODIMM_A11: U1.AN3(IO,_LVDS3C_18p) ; port DDR4_SODIMM_ADDR.A11
DDR4_SODIMM_A12: U1.AL3(IO,_LVDS3C_17p) ; port DDR4_SODIMM_ADDR.A12
DDR4_SODIMM_A13: U1.AG7(IO,_LVDS3C_11n) ; port DDR4_SODIMM_ADDR.A13
DDR4_SODIMM_A14: U1.AG4(IO,_LVDS3C_7n) ; port DDR4_SODIMM_ADDR.A14
DDR4_SODIMM_A15: U1.AF5(IO,_LVDS3C_8n) ; port DDR4_SODIMM_ADDR.A15
DDR4_SODIMM_A16: U1.AF4(IO,_LVDS3C_8p) ; port DDR4_SODIMM_ADDR.A16
DDR4_SODIMM_CK0_N: R239.2 U1.AE8(IO,_LVDS3C_4n) ; port DDR4_SODIMM1_CK.CK0_N
DDR4_SODIMM_CK0_P: R239.1 U1.AF8(IO,_LVDS3C_4p) ; port DDR4_SODIMM1_CK.CK0_P
DDR4_SODIMM_CK1_N: R238.2 U1.AH3(IO,_PLL_3C_CLKOUT1n,_LVDS3C_10n) ; port DDR4_SODIMM1_CK.CK1_N
DDR4_SODIMM_CK1_P: R238.1 U1.AJ3(IO,_PLL_3C_CLKOUT1p,_PLL_3C_CLKOUT1,_PLL_3C_FB1,_LVDS3C_10p) ; port DDR4_SODIMM1_CK.CK1_P
DDR4_SODIMM_CK2_N: R240.2 U1.AK5(IO,_LVDS3C_16n) ; port DDR4_SODIMM2_CK.CK2_N
DDR4_SODIMM_CK2_P: R240.1 U1.AL5(IO,_LVDS3C_16p) ; port DDR4_SODIMM2_CK.CK2_P
DDR4_SODIMM_CK3_N: R241.2 U1.AR2(IO,_LVDS3C_22n) ; port DDR4_SODIMM2_CK.CK3_N
DDR4_SODIMM_CK3_P: R241.1 U1.AR1(IO,_LVDS3C_22p) ; port DDR4_SODIMM2_CK.CK3_P
DDR4_SODIMM_DM0: U1.AL9(IO,_CLK_3B_1p,_LVDS3B_12p) ; port DDR4_SODIMM_BYTELINE0.DM0
DDR4_SODIMM_DM1: U1.AW4(IO,_LVDS3B_24p) ; port DDR4_SODIMM_BYTELINE1.DM1
DDR4_SODIMM_DM2: U1.AN4(IO,_CLK_3B_0p,_LVDS3B_13p) ; port DDR4_SODIMM_BYTELINE2.DM2
DDR4_SODIMM_DM3: U1.AJ9(IO,_LVDS3B_2p) ; port DDR4_SODIMM_BYTELINE3.DM3
DDR4_SODIMM_DQ0: U1.AM9(IO,_LVDS3B_11n) ; port DDR4_SODIMM_BYTELINE0.DQ0
DDR4_SODIMM_DQ1: U1.AL8(IO,_LVDS3B_9p) ; port DDR4_SODIMM_BYTELINE0.DQ1
DDR4_SODIMM_DQ2: U1.AM6(IO,_LVDS3B_8n) ; port DDR4_SODIMM_BYTELINE0.DQ2
DDR4_SODIMM_DQ3: U1.AL7(IO,_LVDS3B_7p) ; port DDR4_SODIMM_BYTELINE0.DQ3
DDR4_SODIMM_DQ4: U1.AK10(IO,_CLK_3B_1n,_LVDS3B_12n) ; port DDR4_SODIMM_BYTELINE0.DQ4
DDR4_SODIMM_DQ5: U1.AK8(IO,_LVDS3B_9n) ; port DDR4_SODIMM_BYTELINE0.DQ5
DDR4_SODIMM_DQ6: U1.AN6(IO,_LVDS3B_8p) ; port DDR4_SODIMM_BYTELINE0.DQ6
DDR4_SODIMM_DQ7: U1.AK7(IO,_LVDS3B_7n) ; port DDR4_SODIMM_BYTELINE0.DQ7
DDR4_SODIMM_DQ8: U1.AU6(IO,_LVDS3B_23n) ; port DDR4_SODIMM_BYTELINE1.DQ8
DDR4_SODIMM_DQ9: U1.AW5(IO,_LVDS3B_24n) ; port DDR4_SODIMM_BYTELINE1.DQ9
DDR4_SODIMM_DQ10: U1.AU4(IO,_LVDS3B_21n) ; port DDR4_SODIMM_BYTELINE1.DQ10
DDR4_SODIMM_DQ11: U1.AT5(IO,_LVDS3B_19n) ; port DDR4_SODIMM_BYTELINE1.DQ11
DDR4_SODIMM_DQ12: U1.AR6(IO,_LVDS3B_20p) ; port DDR4_SODIMM_BYTELINE1.DQ12
DDR4_SODIMM_DQ13: U1.AU5(IO,_LVDS3B_23p) ; port DDR4_SODIMM_BYTELINE1.DQ13
DDR4_SODIMM_DQ14: U1.AT4(IO,_LVDS3B_19p) ; port DDR4_SODIMM_BYTELINE1.DQ14
DDR4_SODIMM_DQ15: U1.AV4(IO,_LVDS3B_21p) ; port DDR4_SODIMM_BYTELINE1.DQ15
DDR4_SODIMM_DQ16: U1.AU1(IO,_LVDS3B_17p) ; port DDR4_SODIMM_BYTELINE2.DQ16
DDR4_SODIMM_DQ17: U1.AR3(IO,_LVDS3B_14p) ; port DDR4_SODIMM_BYTELINE2.DQ17
DDR4_SODIMM_DQ18: U1.AM5(IO,_CLK_3B_0n,_LVDS3B_13n) ; port DDR4_SODIMM_BYTELINE2.DQ18
DDR4_SODIMM_DQ19: U1.AP4(IO,_PLL_3B_CLKOUT0p,_PLL_3B_CLKOUT0,_PLL_3B_FB0,_LVDS3B_15p) ; port DDR4_SODIMM_BYTELINE2.DQ19
DDR4_SODIMM_DQ20: U1.AU2(IO,_LVDS3B_17n) ; port DDR4_SODIMM_BYTELINE2.DQ20
DDR4_SODIMM_DQ21: U1.AT3(IO,_LVDS3B_18n) ; port DDR4_SODIMM_BYTELINE2.DQ21
DDR4_SODIMM_DQ22: U1.AP5(IO,_PLL_3B_CLKOUT0n,_LVDS3B_15n) ; port DDR4_SODIMM_BYTELINE2.DQ22
DDR4_SODIMM_DQ23: U1.AP3(IO,_LVDS3B_14n) ; port DDR4_SODIMM_BYTELINE2.DQ23
DDR4_SODIMM_DQ24: U1.AH11(IO,_LVDS3B_5p) ; port DDR4_SODIMM_BYTELINE3.DQ24
DDR4_SODIMM_DQ25: U1.AH9(IO,_LVDS3B_2n) ; port DDR4_SODIMM_BYTELINE3.DQ25
DDR4_SODIMM_DQ26: U1.AH8(IO,_LVDS3B_1n) ; port DDR4_SODIMM_BYTELINE3.DQ26
DDR4_SODIMM_DQ27: U1.AF12(IO,_LVDS3B_3n) ; port DDR4_SODIMM_BYTELINE3.DQ27
DDR4_SODIMM_DQ28: U1.AG12(IO,_LVDS3B_3p) ; port DDR4_SODIMM_BYTELINE3.DQ28
DDR4_SODIMM_DQ29: U1.AJ10(IO,_LVDS3B_6p) ; port DDR4_SODIMM_BYTELINE3.DQ29
DDR4_SODIMM_DQ30: U1.AJ8(IO,_LVDS3B_1p) ; port DDR4_SODIMM_BYTELINE3.DQ30
DDR4_SODIMM_DQ31: U1.AG11(IO,_LVDS3B_5n) ; port DDR4_SODIMM_BYTELINE3.DQ31
DDR4_SODIMM_DQS0_N: U1.AM7(IO,_PLL_3B_CLKOUT1n,_LVDS3B_10n) ; port DDR4_SODIMM_BYTELINE0.DQS0_N
DDR4_SODIMM_DQS0_P: U1.AN7(IO,_PLL_3B_CLKOUT1p,_PLL_3B_CLKOUT1,_PLL_3B_FB1,_LVDS3B_10p) ; port DDR4_SODIMM_BYTELINE0.DQS0_P
DDR4_SODIMM_DQS1_N: U1.AV6(IO,_LVDS3B_22n) ; port DDR4_SODIMM_BYTELINE1.DQS1_N
DDR4_SODIMM_DQS1_P: U1.AW6(IO,_LVDS3B_22p) ; port DDR4_SODIMM_BYTELINE1.DQS1_P
DDR4_SODIMM_DQS2_N: U1.AP6(IO,_LVDS3B_16n) ; port DDR4_SODIMM_BYTELINE2.DQS2_N
DDR4_SODIMM_DQS2_P: U1.AR5(IO,_LVDS3B_16p) ; port DDR4_SODIMM_BYTELINE2.DQS2_P
DDR4_SODIMM_DQS3_N: U1.AG10(IO,_LVDS3B_4n) ; port DDR4_SODIMM_BYTELINE3.DQS3_N
DDR4_SODIMM_DQS3_P: U1.AG9(IO,_LVDS3B_4p) ; port DDR4_SODIMM_BYTELINE3.DQS3_P
NetR237_2: R237.2 U1.AH7(IO,_RZQ_3C,_LVDS3C_11p)

Not connected (* = marked no-connect by the designer): U1 AC8(IO,_LVDS3C_1p) AC9(IO,_LVDS3C_1n) AC11(IO,_LVDS3C_5n) AD8(IO,_LVDS3C_3p) AD9(IO,_LVDS3C_3n) AD10(IO,_LVDS3C_5p) AE7(IO,_LVDS3C_9n) AE10(IO,_LVDS3C_2p) AE11(IO,_LVDS3C_2n) AF7(IO,_LVDS3C_9p) AF9(IO,_LVDS3C_6p) AF10(IO,_LVDS3C_6n) AG5(IO,_CLK_3C_1p,_LVDS3C_12p) AG6(IO,_CLK_3C_1n,_LVDS3C_12n) AH6(IO,_CLK_3C_0n,_LVDS3C_13n) AJ5(IO,_CLK_3C_0p,_LVDS3C_13p) AJ6(IO,_PLL_3C_CLKOUT0n,_LVDS3C_15n) AJ11(IO,_LVDS3B_6n) AK6(IO,_PLL_3C_CLKOUT0p,_PLL_3C_CLKOUT0,_PLL_3C_FB0,_LVDS3C_15p) AL2(IO,_LVDS3C_23n) AM2(IO,_LVDS3C_23p) AN2(IO,_LVDS3C_24n) AN8(IO,_RZQ_3B,_LVDS3B_11p) AP1(IO,_LVDS3C_24p) AR7(IO,_LVDS3B_20n) AT2(IO,_LVDS3B_18p)

### Layout directives
differential pair: DDR4_SODIMM_CK0_N, DDR4_SODIMM_CK0_P, DDR4_SODIMM_CK1_N, DDR4_SODIMM_CK1_P, DDR4_SODIMM_CK2_N, DDR4_SODIMM_CK2_P, DDR4_SODIMM_CK3_N, DDR4_SODIMM_CK3_P, DDR4_SODIMM_DQS0_N, DDR4_SODIMM_DQS0_P, DDR4_SODIMM_DQS1_N, DDR4_SODIMM_DQS1_P, DDR4_SODIMM_DQS2_N, DDR4_SODIMM_DQS2_P, DDR4_SODIMM_DQS3_N, DDR4_SODIMM_DQS3_P

### Notes on the sheet
- Title
- Size:
- Date:
- B
- Number:
- Time:
- Revision:
- Sheet
- of
- File:
- (in symbol CMP-1689-00006-3, part G) BANK 3B
- (in symbol CMP-1689-00006-3, part H) BANK 3C

### Library data of the parts
R237-R241 = CMP-2002-07994-2: Chip Resistor, 39 Ohm, +/- 5%, 0.063 W, -55 to 155 degC, 0402 (1005 Metric), RoHS, Tape and Reel; Power Rating: 63 mW; Voltage Rating (DC): 50 V; Case Code (Imperial): 0402; Mount: Surface Mount; Max Operating Temperature: 155 degC; Case Code (Metric): 1005; ComponentLink1Description: Manufacturer URL; PackageDescription: 2-Pin Surface Mount Device, Body 1 x 0.5 mm; PartNumber: RC0402JR-0739RL; ComponentLink2Description: Datasheet; Tolerance: 5%; Height: 0.35 mm; Pins: 2; Min Operating Temperature: -55 degC; Length: 1 mm; DatasheetVersion: Rev. 4, 02/2016; ComponentLink2URL: http://www.yageo.com/documents/recent/PYu-RC_Group_51_RoHS_L_04.pdf; Mounting Technology: Surface Mount; Packaging: Cut Tape; Case/Package: 0402; Package Quantity: 1; RoHSCompliant: true; REACH SVHC: No SVHC; Width: 0.5 mm; Voltage Rating: 50 V; ComponentLink1URL: http://www.yageo.com/
U1 = CMP-1689-00006-3: as U1 on sheet DDR4_Arria10; ComponentLink3Description: Package Specification; PackageVersion: Rev. 5.0, 01/2016; ComponentLink3URL: https://www.altera.com/content/dam/altera-www/global/en_US/pdfs/literature/packaging/04r00461-04.pdf; ComponentLink2Description: Datasheet; Code_JEDEC: MS-034; Mounting Technology: Surface Mount; PartNumber: 10AS066N3F40E2SGE2; PackageDescription: 1517-Pin FineLine Ball-Grid Array (FBGA), Body 40 x 40 mm, Pitch 1 mm; ComponentLink2URL: https://www.altera.com/content/dam/altera-www/global/en_US/pdfs/literature/hb/arria-10/a10_datasheet.pdf; ComponentLink1URL: https://www.altera.com/; DatasheetVersion: Rev. 2016-06-24, 06/2016; ComponentLink1Description: Manufacturer URL

## Sheet miniPCIE_Arria10.SchDoc: miniPCIE Arria10
size B; DocumentNumber: 23; SheetNumber: 23; SheetTotal: 46
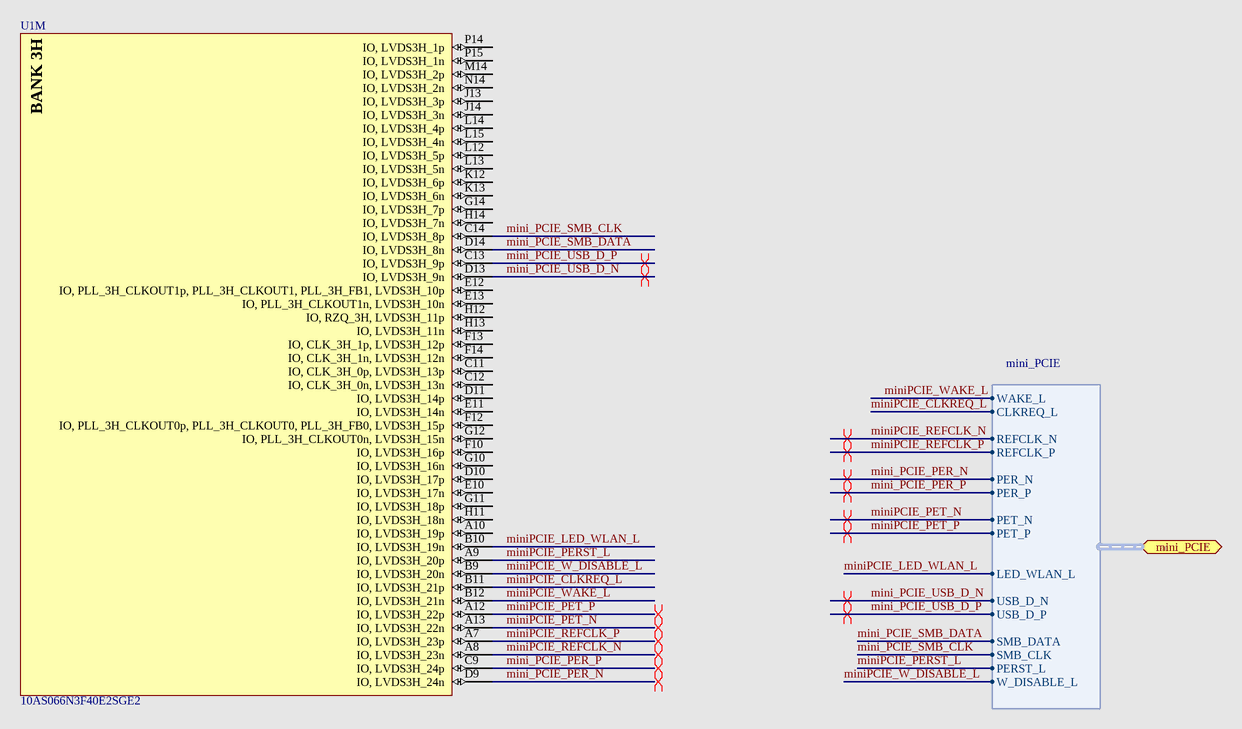
[diagram p12: miniPCIE_Arria10.SchDoc]

### Parts
U1  10AS066N3F40E2SGE2  [ALTR-FBGA1517_A-350]  (part M of 31)

### Ports
mini_PCIE (harness mini_PCIE)

### Harnesses
mini_PCIE: WAKE_L, CLKREQ_L, REFCLK_N, REFCLK_P, PER_N, PER_P, PET_N, PET_P, LED_WLAN_L, USB_D_N, USB_D_P, SMB_DATA, SMB_CLK, PERST_L, W_DISABLE_L

### Nets
mini_PCIE_PER_N: U1.D9(IO,_LVDS3H_24n) ; port mini_PCIE.PER_N
mini_PCIE_PER_P: U1.C9(IO,_LVDS3H_24p) ; port mini_PCIE.PER_P
mini_PCIE_SMB_CLK: U1.C14(IO,_LVDS3H_8p) ; port mini_PCIE.SMB_CLK
mini_PCIE_SMB_DATA: U1.D14(IO,_LVDS3H_8n) ; port mini_PCIE.SMB_DATA
mini_PCIE_USB_D_N: U1.D13(IO,_LVDS3H_9n) ; port mini_PCIE.USB_D_N
mini_PCIE_USB_D_P: U1.C13(IO,_LVDS3H_9p) ; port mini_PCIE.USB_D_P
miniPCIE_CLKREQ_L: U1.B11(IO,_LVDS3H_21p) ; port mini_PCIE.CLKREQ_L
miniPCIE_LED_WLAN_L: U1.B10(IO,_LVDS3H_19n) ; port mini_PCIE.LED_WLAN_L
miniPCIE_PERST_L: U1.A9(IO,_LVDS3H_20p) ; port mini_PCIE.PERST_L
miniPCIE_PET_N: U1.A13(IO,_LVDS3H_22n) ; port mini_PCIE.PET_N
miniPCIE_PET_P: U1.A12(IO,_LVDS3H_22p) ; port mini_PCIE.PET_P
miniPCIE_REFCLK_N: U1.A8(IO,_LVDS3H_23n) ; port mini_PCIE.REFCLK_N
miniPCIE_REFCLK_P: U1.A7(IO,_LVDS3H_23p) ; port mini_PCIE.REFCLK_P
miniPCIE_W_DISABLE_L: U1.B9(IO,_LVDS3H_20n) ; port mini_PCIE.W_DISABLE_L
miniPCIE_WAKE_L: U1.B12(IO,_LVDS3H_21n) ; port mini_PCIE.WAKE_L

Not connected (* = marked no-connect by the designer): U1 A10(IO,_LVDS3H_19p) C11(IO,_CLK_3H_0p,_LVDS3H_13p) C12(IO,_CLK_3H_0n,_LVDS3H_13n) D10(IO,_LVDS3H_17p) D11(IO,_LVDS3H_14p) E10(IO,_LVDS3H_17n) E11(IO,_LVDS3H_14n) E12(IO,_PLL_3H_CLKOUT1p,_PLL_3H_CLKOUT1,_PLL_3H_FB1,_LVDS3H_10p) E13(IO,_PLL_3H_CLKOUT1n,_LVDS3H_10n) F10(IO,_LVDS3H_16p) F12(IO,_PLL_3H_CLKOUT0p,_PLL_3H_CLKOUT0,_PLL_3H_FB0,_LVDS3H_15p) F13(IO,_CLK_3H_1p,_LVDS3H_12p) F14(IO,_CLK_3H_1n,_LVDS3H_12n) G10(IO,_LVDS3H_16n) G11(IO,_LVDS3H_18p) G12(IO,_PLL_3H_CLKOUT0n,_LVDS3H_15n) G14(IO,_LVDS3H_7p) H11(IO,_LVDS3H_18n) H12(IO,_RZQ_3H,_LVDS3H_11p) H13(IO,_LVDS3H_11n) H14(IO,_LVDS3H_7n) J13(IO,_LVDS3H_3p) J14(IO,_LVDS3H_3n) K12(IO,_LVDS3H_6p) K13(IO,_LVDS3H_6n) L12(IO,_LVDS3H_5p) L13(IO,_LVDS3H_5n) L14(IO,_LVDS3H_4p) L15(IO,_LVDS3H_4n) M14(IO,_LVDS3H_2p) N14(IO,_LVDS3H_2n) P14(IO,_LVDS3H_1p) P15(IO,_LVDS3H_1n)

### Layout directives
differential pair: mini_PCIE_PER_N, mini_PCIE_PER_P, mini_PCIE_USB_D_N, mini_PCIE_USB_D_P, miniPCIE_PET_N, miniPCIE_PET_P, miniPCIE_REFCLK_N, miniPCIE_REFCLK_P

### Notes on the sheet
- Title
- Size:
- Date:
- B
- Number:
- Time:
- Revision:
- Sheet
- of
- File:
- (in symbol CMP-1689-00006-3, part M) BANK 3H

### Library data of the parts
U1 = CMP-1689-00006-3: as U1 on sheet DDR4_Arria10; ComponentLink3Description: Package Specification; PackageVersion: Rev. 5.0, 01/2016; ComponentLink3URL: https://www.altera.com/content/dam/altera-www/global/en_US/pdfs/literature/packaging/04r00461-04.pdf; ComponentLink2Description: Datasheet; Code_JEDEC: MS-034; Mounting Technology: Surface Mount; PartNumber: 10AS066N3F40E2SGE2; PackageDescription: 1517-Pin FineLine Ball-Grid Array (FBGA), Body 40 x 40 mm, Pitch 1 mm; ComponentLink2URL: https://www.altera.com/content/dam/altera-www/global/en_US/pdfs/literature/hb/arria-10/a10_datasheet.pdf; ComponentLink1URL: https://www.altera.com/; DatasheetVersion: Rev. 2016-06-24, 06/2016; ComponentLink1Description: Manufacturer URL

## Sheet USB3.0_Arria10.SchDoc: USB3.0
size B; DocumentNumber: 28; SheetNumber: 28; SheetTotal: 46
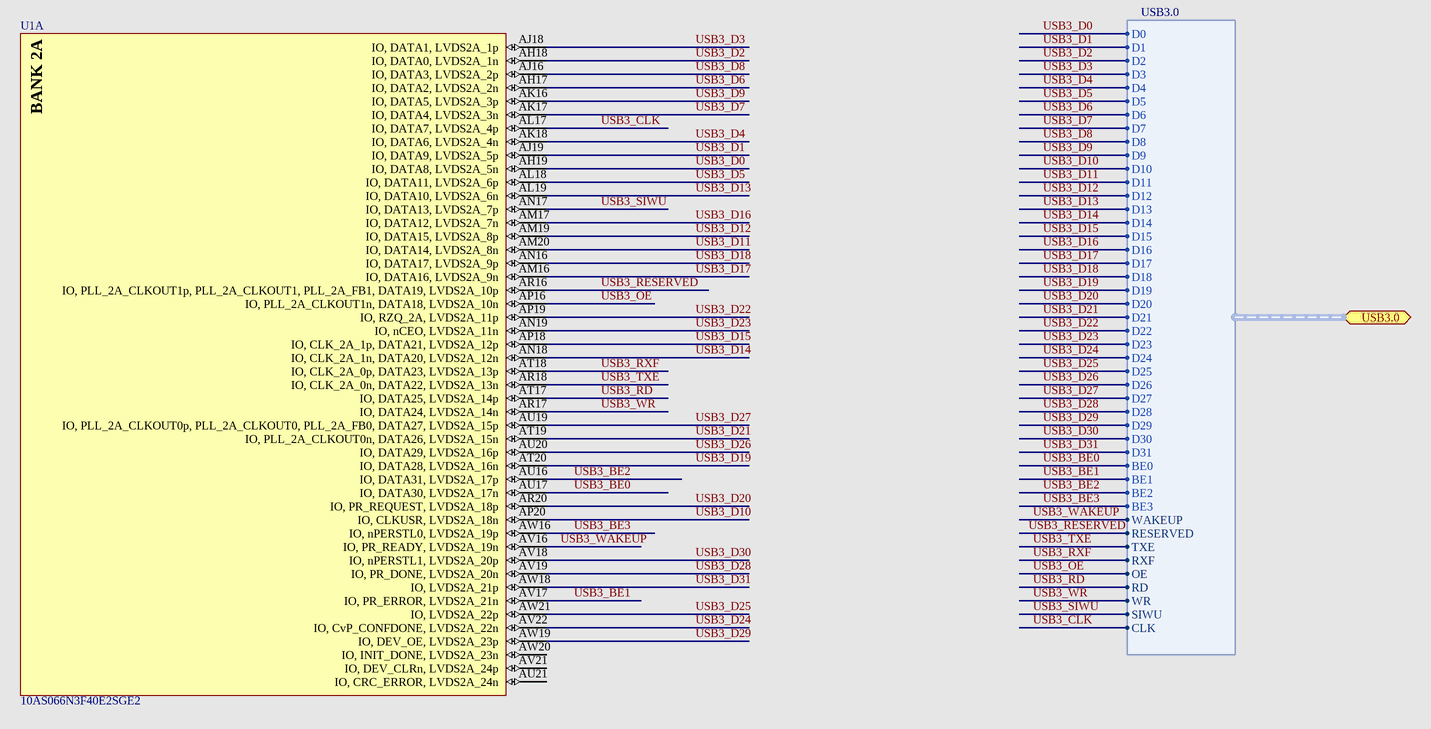
[diagram p13: USB3.0_Arria10.SchDoc]

### Parts
U1  10AS066N3F40E2SGE2  [ALTR-FBGA1517_A-350]  (part A of 31)

### Ports
USB3.0 (harness USB3.0)

### Harnesses
USB3.0: RD, OE, RXF, TXE, RESERVED, WAKEUP, WR, SIWU, CLK, D0, D1, D2, D3, D4, D5, D6, D7, D8, D9, D10, D11, D12, D13, D14, D15, D16, D17, D18, D19, D20, D21, D22, D23, D24, D25, D26, D27, D28, D29, D30, D31, BE0, BE1, BE2, BE3

### Nets
USB3_BE0: U1.AU17(IO,_DATA30,_LVDS2A_17n) ; port USB3.0.BE0
USB3_BE1: U1.AV17(IO,_PR_ERROR,_LVDS2A_21n) ; port USB3.0.BE1
USB3_BE2: U1.AU16(IO,_DATA31,_LVDS2A_17p) ; port USB3.0.BE2
USB3_BE3: U1.AW16(IO,_nPERSTL0,_LVDS2A_19p) ; port USB3.0.BE3
USB3_CLK: U1.AL17(IO,_DATA7,_LVDS2A_4p) ; port USB3.0.CLK
USB3_D0: U1.AH19(IO,_DATA8,_LVDS2A_5n) ; port USB3.0.D0
USB3_D1: U1.AJ19(IO,_DATA9,_LVDS2A_5p) ; port USB3.0.D1
USB3_D2: U1.AH18(IO,_DATA0,_LVDS2A_1n) ; port USB3.0.D2
USB3_D3: U1.AJ18(IO,_DATA1,_LVDS2A_1p) ; port USB3.0.D3
USB3_D4: U1.AK18(IO,_DATA6,_LVDS2A_4n) ; port USB3.0.D4
USB3_D5: U1.AL18(IO,_DATA11,_LVDS2A_6p) ; port USB3.0.D5
USB3_D6: U1.AH17(IO,_DATA2,_LVDS2A_2n) ; port USB3.0.D6
USB3_D7: U1.AK17(IO,_DATA4,_LVDS2A_3n) ; port USB3.0.D7
USB3_D8: U1.AJ16(IO,_DATA3,_LVDS2A_2p) ; port USB3.0.D8
USB3_D9: U1.AK16(IO,_DATA5,_LVDS2A_3p) ; port USB3.0.D9
USB3_D10: U1.AP20(IO,_CLKUSR,_LVDS2A_18n) ; port USB3.0.D10
USB3_D11: U1.AM20(IO,_DATA14,_LVDS2A_8n) ; port USB3.0.D11
USB3_D12: U1.AM19(IO,_DATA15,_LVDS2A_8p) ; port USB3.0.D12
USB3_D13: U1.AL19(IO,_DATA10,_LVDS2A_6n) ; port USB3.0.D13
USB3_D14: U1.AN18(IO,_CLK_2A_1n,_DATA20,_LVDS2A_12n) ; port USB3.0.D14
USB3_D15: U1.AP18(IO,_CLK_2A_1p,_DATA21,_LVDS2A_12p) ; port USB3.0.D15
USB3_D16: U1.AM17(IO,_DATA12,_LVDS2A_7n) ; port USB3.0.D16
USB3_D17: U1.AM16(IO,_DATA16,_LVDS2A_9n) ; port USB3.0.D17
USB3_D18: U1.AN16(IO,_DATA17,_LVDS2A_9p) ; port USB3.0.D18
USB3_D19: U1.AT20(IO,_DATA28,_LVDS2A_16n) ; port USB3.0.D19
USB3_D20: U1.AR20(IO,_PR_REQUEST,_LVDS2A_18p) ; port USB3.0.D20
USB3_D21: U1.AT19(IO,_PLL_2A_CLKOUT0n,_DATA26,_LVDS2A_15n) ; port USB3.0.D21
USB3_D22: U1.AP19(IO,_RZQ_2A,_LVDS2A_11p) ; port USB3.0.D22
USB3_D23: U1.AN19(IO,_nCEO,_LVDS2A_11n) ; port USB3.0.D23
USB3_D24: U1.AV22(IO,_CvP_CONFDONE,_LVDS2A_22n) ; port USB3.0.D24
USB3_D25: U1.AW21(IO,_LVDS2A_22p) ; port USB3.0.D25
USB3_D26: U1.AU20(IO,_DATA29,_LVDS2A_16p) ; port USB3.0.D26
USB3_D27: U1.AU19(IO,_PLL_2A_CLKOUT0p,_PLL_2A_CLKOUT0,_PLL_2A_FB0,_DATA27,_LVDS2A_15p) ; port USB3.0.D27
USB3_D28: U1.AV19(IO,_PR_DONE,_LVDS2A_20n) ; port USB3.0.D28
USB3_D29: U1.AW19(IO,_DEV_OE,_LVDS2A_23p) ; port USB3.0.D29
USB3_D30: U1.AV18(IO,_nPERSTL1,_LVDS2A_20p) ; port USB3.0.D30
USB3_D31: U1.AW18(IO,_LVDS2A_21p) ; port USB3.0.D31
USB3_OE: U1.AP16(IO,_PLL_2A_CLKOUT1n,_DATA18,_LVDS2A_10n) ; port USB3.0.OE
USB3_RD: U1.AT17(IO,_DATA25,_LVDS2A_14p) ; port USB3.0.RD
USB3_RESERVED: U1.AR16(IO,_PLL_2A_CLKOUT1p,_PLL_2A_CLKOUT1,_PLL_2A_FB1,_DATA19,_LVDS2A_10p) ; port USB3.0.RESERVED
USB3_RXF: U1.AT18(IO,_CLK_2A_0p,_DATA23,_LVDS2A_13p) ; port USB3.0.RXF
USB3_SIWU: U1.AN17(IO,_DATA13,_LVDS2A_7p) ; port USB3.0.SIWU
USB3_TXE: U1.AR18(IO,_CLK_2A_0n,_DATA22,_LVDS2A_13n) ; port USB3.0.TXE
USB3_WAKEUP: U1.AV16(IO,_PR_READY,_LVDS2A_19n) ; port USB3.0.WAKEUP
USB3_WR: U1.AR17(IO,_DATA24,_LVDS2A_14n) ; port USB3.0.WR

Not connected (* = marked no-connect by the designer): U1 AU21(IO,_CRC_ERROR,_LVDS2A_24n) AV21(IO,_DEV_CLRn,_LVDS2A_24p) AW20(IO,_INIT_DONE,_LVDS2A_23n)

### Notes on the sheet
- Title
- Size:
- Date:
- B
- Number:
- Time:
- Revision:
- Sheet
- of
- File:
- (in symbol CMP-1689-00006-3, part A) BANK 2A

### Library data of the parts
U1 = CMP-1689-00006-3: as U1 on sheet DDR4_Arria10; ComponentLink3Description: Package Specification; PackageVersion: Rev. 5.0, 01/2016; ComponentLink3URL: https://www.altera.com/content/dam/altera-www/global/en_US/pdfs/literature/packaging/04r00461-04.pdf; ComponentLink2Description: Datasheet; Code_JEDEC: MS-034; Mounting Technology: Surface Mount; PartNumber: 10AS066N3F40E2SGE2; PackageDescription: 1517-Pin FineLine Ball-Grid Array (FBGA), Body 40 x 40 mm, Pitch 1 mm; ComponentLink2URL: https://www.altera.com/content/dam/altera-www/global/en_US/pdfs/literature/hb/arria-10/a10_datasheet.pdf; ComponentLink1URL: https://www.altera.com/; DatasheetVersion: Rev. 2016-06-24, 06/2016; ComponentLink1Description: Manufacturer URL

## Sheet PCIE_Arria10.SchDoc: PCIE & Ethernet
size B; DocumentNumber: 24; SheetNumber: 24; SheetTotal: 46
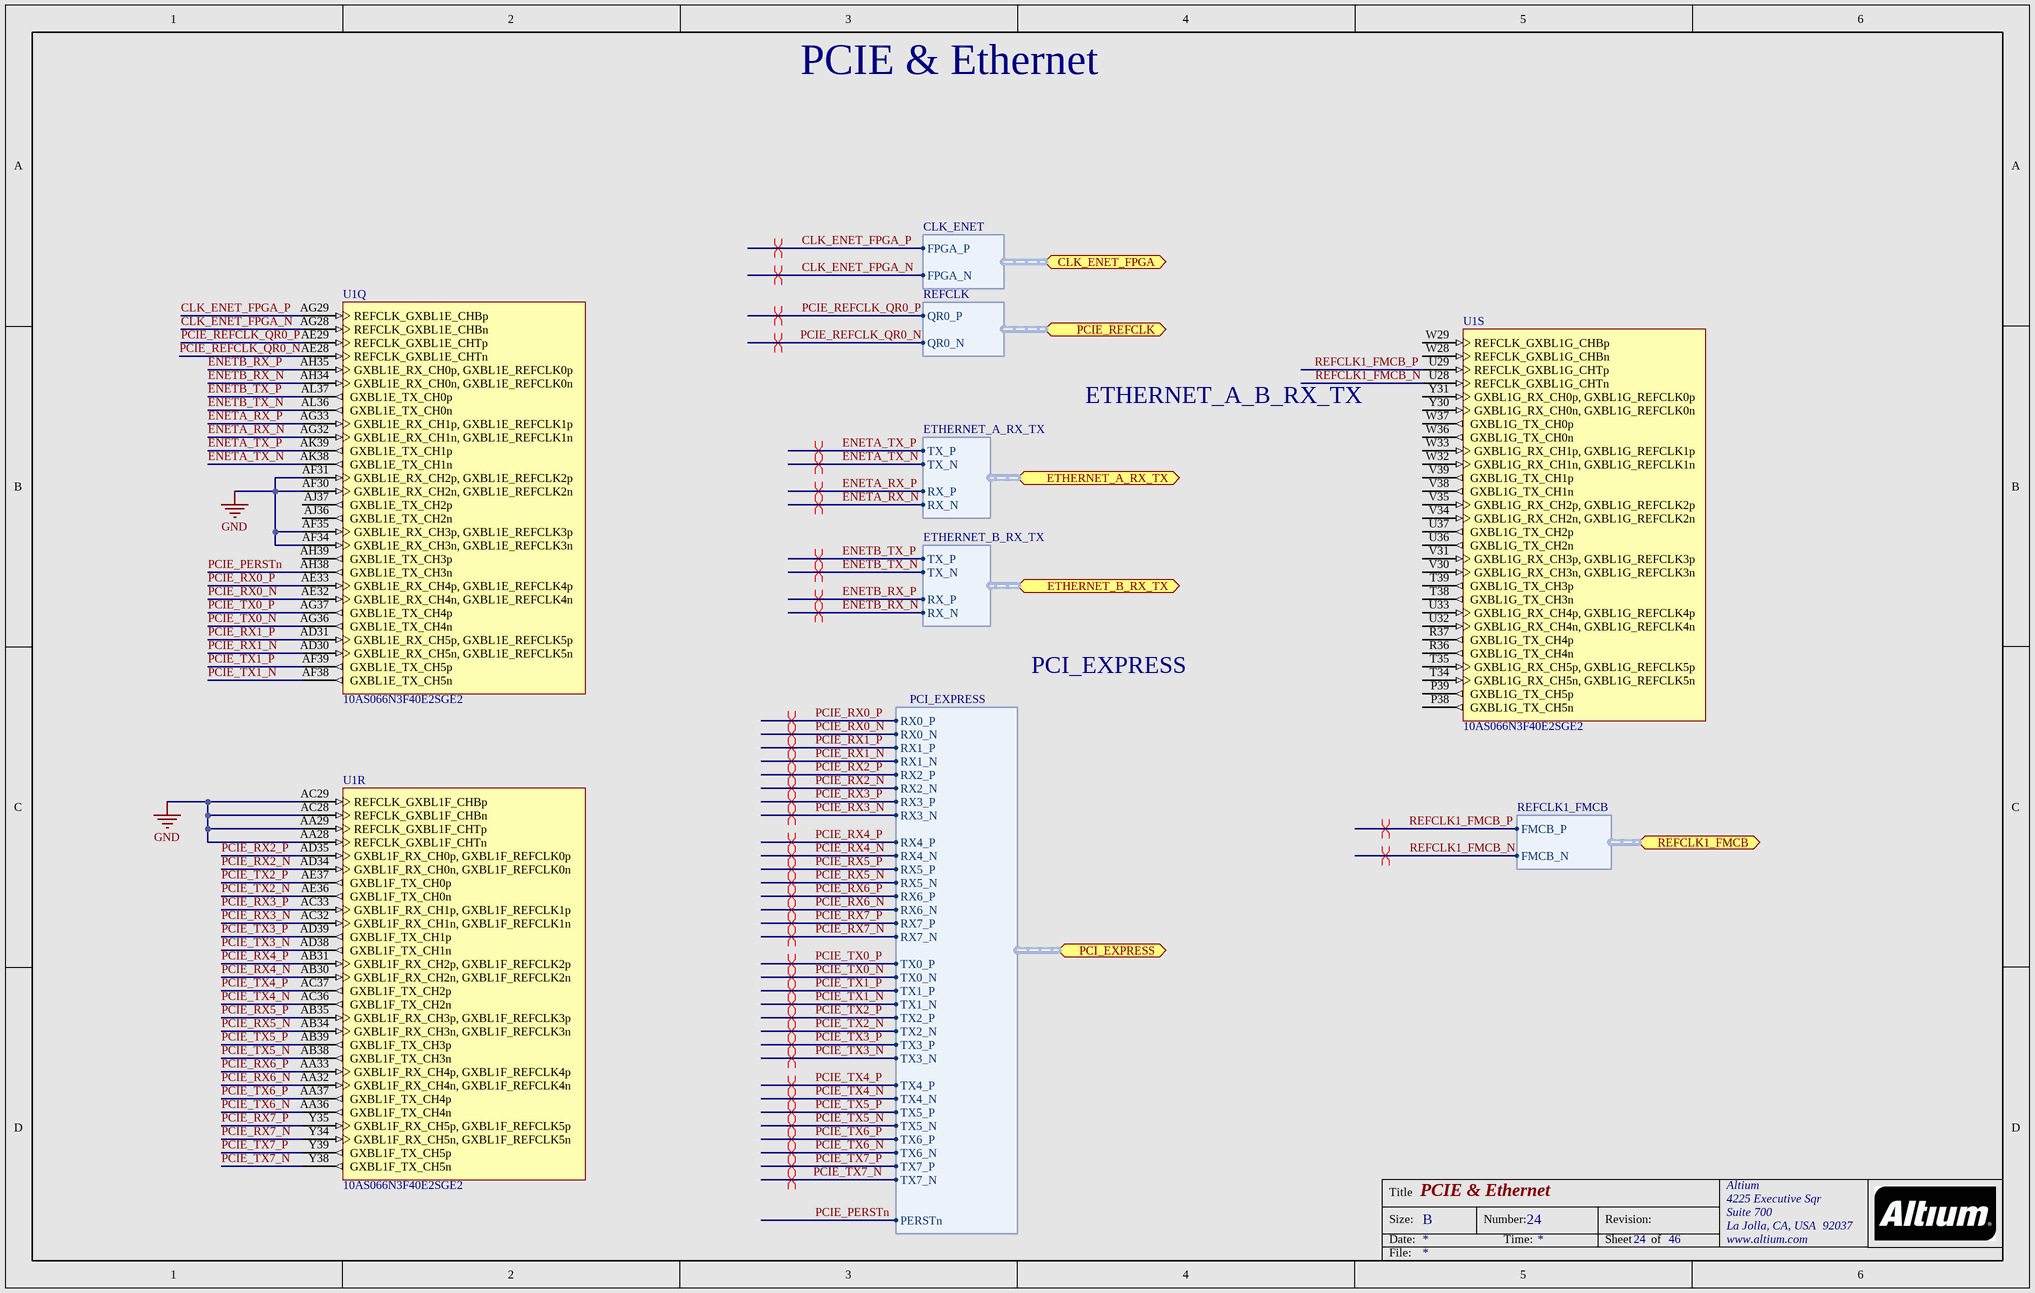
[diagram p14: PCIE_Arria10.SchDoc]

### Parts
U1  10AS066N3F40E2SGE2  [ALTR-FBGA1517_A-350]  (parts Q,R,S of 31)

### Ports
CLK_ENET_FPGA (harness CLK_ENET), ETHERNET_A_RX_TX (harness ETHERNET_A_RX_TX), ETHERNET_B_RX_TX (harness ETHERNET_B_RX_TX), PCI_EXPRESS (harness PCI_EXPRESS), PCIE_REFCLK (harness REFCLK), REFCLK1_FMCB (harness REFCLK1_FMCB)

### Harnesses
ETHERNET_A_RX_TX: RX_P, RX_N, TX_P, TX_N
ETHERNET_B_RX_TX: RX_P, RX_N, TX_P, TX_N
PCI_EXPRESS: RX0_P, RX0_N, RX1_P, RX1_N, RX2_P, RX2_N, RX3_P, RX3_N, RX7_N, RX7_P, RX4_P, RX4_N, RX5_P, RX5_N, RX6_P, RX6_N, TX0_P, TX0_N, TX1_P, TX1_N, TX2_P, TX2_N, TX3_P, TX3_N, TX7_N, TX7_P, TX4_P, TX4_N, TX5_P, TX5_N, TX6_P, TX6_N, PERSTn
CLK_ENET: FPGA_P, FPGA_N
REFCLK: QR0_P, QR0_N
REFCLK1_FMCB: FMCB_P, FMCB_N

### Nets
GND: U1.AA28(REFCLK_GXBL1F_CHTn) U1.AA29(REFCLK_GXBL1F_CHTp) U1.AC28(REFCLK_GXBL1F_CHBn) U1.AC29(REFCLK_GXBL1F_CHBp) U1.AF30(GXBL1E_RX_CH2n,_GXBL1E_REFCLK2n) U1.AF31(GXBL1E_RX_CH2p,_GXBL1E_REFCLK2p) U1.AF34(GXBL1E_RX_CH3n,_GXBL1E_REFCLK3n) U1.AF35(GXBL1E_RX_CH3p,_GXBL1E_REFCLK3p)
CLK_ENET_FPGA_N: U1.AG28(REFCLK_GXBL1E_CHBn) ; port CLK_ENET_FPGA.FPGA_N
CLK_ENET_FPGA_P: U1.AG29(REFCLK_GXBL1E_CHBp) ; port CLK_ENET_FPGA.FPGA_P
ENETA_RX_N: U1.AG32(GXBL1E_RX_CH1n,_GXBL1E_REFCLK1n) ; port ETHERNET_A_RX_TX.RX_N
ENETA_RX_P: U1.AG33(GXBL1E_RX_CH1p,_GXBL1E_REFCLK1p) ; port ETHERNET_A_RX_TX.RX_P
ENETA_TX_N: U1.AK38(GXBL1E_TX_CH1n) ; port ETHERNET_A_RX_TX.TX_N
ENETA_TX_P: U1.AK39(GXBL1E_TX_CH1p) ; port ETHERNET_A_RX_TX.TX_P
ENETB_RX_N: U1.AH34(GXBL1E_RX_CH0n,_GXBL1E_REFCLK0n) ; port ETHERNET_B_RX_TX.RX_N
ENETB_RX_P: U1.AH35(GXBL1E_RX_CH0p,_GXBL1E_REFCLK0p) ; port ETHERNET_B_RX_TX.RX_P
ENETB_TX_N: U1.AL36(GXBL1E_TX_CH0n) ; port ETHERNET_B_RX_TX.TX_N
ENETB_TX_P: U1.AL37(GXBL1E_TX_CH0p) ; port ETHERNET_B_RX_TX.TX_P
PCIE_PERSTn: U1.AH38(GXBL1E_TX_CH3n) ; port PCI_EXPRESS.PERSTn
PCIE_REFCLK_QR0_N: U1.AE28(REFCLK_GXBL1E_CHTn) ; port PCIE_REFCLK.QR0_N
PCIE_REFCLK_QR0_P: U1.AE29(REFCLK_GXBL1E_CHTp) ; port PCIE_REFCLK.QR0_P
PCIE_RX0_N: U1.AE32(GXBL1E_RX_CH4n,_GXBL1E_REFCLK4n) ; port PCI_EXPRESS.RX0_N
PCIE_RX0_P: U1.AE33(GXBL1E_RX_CH4p,_GXBL1E_REFCLK4p) ; port PCI_EXPRESS.RX0_P
PCIE_RX1_N: U1.AD30(GXBL1E_RX_CH5n,_GXBL1E_REFCLK5n) ; port PCI_EXPRESS.RX1_N
PCIE_RX1_P: U1.AD31(GXBL1E_RX_CH5p,_GXBL1E_REFCLK5p) ; port PCI_EXPRESS.RX1_P
PCIE_RX2_N: U1.AD34(GXBL1F_RX_CH0n,_GXBL1F_REFCLK0n) ; port PCI_EXPRESS.RX2_N
PCIE_RX2_P: U1.AD35(GXBL1F_RX_CH0p,_GXBL1F_REFCLK0p) ; port PCI_EXPRESS.RX2_P
PCIE_RX3_N: U1.AC32(GXBL1F_RX_CH1n,_GXBL1F_REFCLK1n) ; port PCI_EXPRESS.RX3_N
PCIE_RX3_P: U1.AC33(GXBL1F_RX_CH1p,_GXBL1F_REFCLK1p) ; port PCI_EXPRESS.RX3_P
PCIE_RX4_N: U1.AB30(GXBL1F_RX_CH2n,_GXBL1F_REFCLK2n) ; port PCI_EXPRESS.RX4_N
PCIE_RX4_P: U1.AB31(GXBL1F_RX_CH2p,_GXBL1F_REFCLK2p) ; port PCI_EXPRESS.RX4_P
PCIE_RX5_N: U1.AB34(GXBL1F_RX_CH3n,_GXBL1F_REFCLK3n) ; port PCI_EXPRESS.RX5_N
PCIE_RX5_P: U1.AB35(GXBL1F_RX_CH3p,_GXBL1F_REFCLK3p) ; port PCI_EXPRESS.RX5_P
PCIE_RX6_N: U1.AA32(GXBL1F_RX_CH4n,_GXBL1F_REFCLK4n) ; port PCI_EXPRESS.RX6_N
PCIE_RX6_P: U1.AA33(GXBL1F_RX_CH4p,_GXBL1F_REFCLK4p) ; port PCI_EXPRESS.RX6_P
PCIE_RX7_N: U1.Y34(GXBL1F_RX_CH5n,_GXBL1F_REFCLK5n) ; port PCI_EXPRESS.RX7_N
PCIE_RX7_P: U1.Y35(GXBL1F_RX_CH5p,_GXBL1F_REFCLK5p) ; port PCI_EXPRESS.RX7_P
PCIE_TX0_N: U1.AG36(GXBL1E_TX_CH4n) ; port PCI_EXPRESS.TX0_N
PCIE_TX0_P: U1.AG37(GXBL1E_TX_CH4p) ; port PCI_EXPRESS.TX0_P
PCIE_TX1_N: U1.AF38(GXBL1E_TX_CH5n) ; port PCI_EXPRESS.TX1_N
PCIE_TX1_P: U1.AF39(GXBL1E_TX_CH5p) ; port PCI_EXPRESS.TX1_P
PCIE_TX2_N: U1.AE36(GXBL1F_TX_CH0n) ; port PCI_EXPRESS.TX2_N
PCIE_TX2_P: U1.AE37(GXBL1F_TX_CH0p) ; port PCI_EXPRESS.TX2_P
PCIE_TX3_N: U1.AD38(GXBL1F_TX_CH1n) ; port PCI_EXPRESS.TX3_N
PCIE_TX3_P: U1.AD39(GXBL1F_TX_CH1p) ; port PCI_EXPRESS.TX3_P
PCIE_TX4_N: U1.AC36(GXBL1F_TX_CH2n) ; port PCI_EXPRESS.TX4_N
PCIE_TX4_P: U1.AC37(GXBL1F_TX_CH2p) ; port PCI_EXPRESS.TX4_P
PCIE_TX5_N: U1.AB38(GXBL1F_TX_CH3n) ; port PCI_EXPRESS.TX5_N
PCIE_TX5_P: U1.AB39(GXBL1F_TX_CH3p) ; port PCI_EXPRESS.TX5_P
PCIE_TX6_N: U1.AA36(GXBL1F_TX_CH4n) ; port PCI_EXPRESS.TX6_N
PCIE_TX6_P: U1.AA37(GXBL1F_TX_CH4p) ; port PCI_EXPRESS.TX6_P
PCIE_TX7_N: U1.Y38(GXBL1F_TX_CH5n) ; port PCI_EXPRESS.TX7_N
PCIE_TX7_P: U1.Y39(GXBL1F_TX_CH5p) ; port PCI_EXPRESS.TX7_P
REFCLK1_FMCB_N: U1.U28(REFCLK_GXBL1G_CHTn) ; port REFCLK1_FMCB.FMCB_N
REFCLK1_FMCB_P: U1.U29(REFCLK_GXBL1G_CHTp) ; port REFCLK1_FMCB.FMCB_P

Not connected (* = marked no-connect by the designer): U1 AH39(GXBL1E_TX_CH3p) AJ36(GXBL1E_TX_CH2n) AJ37(GXBL1E_TX_CH2p) P38(GXBL1G_TX_CH5n) P39(GXBL1G_TX_CH5p) R36(GXBL1G_TX_CH4n) R37(GXBL1G_TX_CH4p) T34(GXBL1G_RX_CH5n,_GXBL1G_REFCLK5n) T35(GXBL1G_RX_CH5p,_GXBL1G_REFCLK5p) T38(GXBL1G_TX_CH3n) T39(GXBL1G_TX_CH3p) U32(GXBL1G_RX_CH4n,_GXBL1G_REFCLK4n) U33(GXBL1G_RX_CH4p,_GXBL1G_REFCLK4p) U36(GXBL1G_TX_CH2n) U37(GXBL1G_TX_CH2p) V30(GXBL1G_RX_CH3n,_GXBL1G_REFCLK3n) V31(GXBL1G_RX_CH3p,_GXBL1G_REFCLK3p) V34(GXBL1G_RX_CH2n,_GXBL1G_REFCLK2n) V35(GXBL1G_RX_CH2p,_GXBL1G_REFCLK2p) V38(GXBL1G_TX_CH1n) V39(GXBL1G_TX_CH1p) W28(REFCLK_GXBL1G_CHBn) W29(REFCLK_GXBL1G_CHBp) W32(GXBL1G_RX_CH1n,_GXBL1G_REFCLK1n) W33(GXBL1G_RX_CH1p,_GXBL1G_REFCLK1p) W36(GXBL1G_TX_CH0n) W37(GXBL1G_TX_CH0p) Y30(GXBL1G_RX_CH0n,_GXBL1G_REFCLK0n) Y31(GXBL1G_RX_CH0p,_GXBL1G_REFCLK0p)

### Layout directives
differential pair: CLK_ENET_FPGA_N, CLK_ENET_FPGA_P, ENETA_RX_N, ENETA_RX_P, ENETA_TX_N, ENETA_TX_P, ENETB_RX_N, ENETB_RX_P, ENETB_TX_N, ENETB_TX_P, PCIE_REFCLK_QR0_N, PCIE_REFCLK_QR0_P, PCIE_RX0_N, PCIE_RX0_P, PCIE_RX1_N, PCIE_RX1_P, PCIE_RX2_N, PCIE_RX2_P, PCIE_RX3_N, PCIE_RX3_P, PCIE_RX4_N, PCIE_RX4_P, PCIE_RX5_N, PCIE_RX5_P, PCIE_RX6_N, PCIE_RX6_P, PCIE_RX7_N, PCIE_RX7_P, PCIE_TX0_N, PCIE_TX0_P, PCIE_TX1_N, PCIE_TX1_P, PCIE_TX2_N, PCIE_TX2_P, PCIE_TX3_N, PCIE_TX3_P, PCIE_TX4_N, PCIE_TX4_P, PCIE_TX5_N, PCIE_TX5_P, PCIE_TX6_N, PCIE_TX6_P, PCIE_TX7_N, PCIE_TX7_P, REFCLK1_FMCB_N, REFCLK1_FMCB_P

### Notes on the sheet
- ETHERNET_A_B_RX_TX
- PCI_EXPRESS
- Title
- Size:
- Date:
- B
- Number:
- Time:
- Revision:
- Sheet
- of
- File:

### Library data of the parts
U1 = CMP-1689-00006-3: as U1 on sheet DDR4_Arria10; ComponentLink3Description: Package Specification; PackageVersion: Rev. 5.0, 01/2016; ComponentLink3URL: https://www.altera.com/content/dam/altera-www/global/en_US/pdfs/literature/packaging/04r00461-04.pdf; ComponentLink2Description: Datasheet; Code_JEDEC: MS-034; Mounting Technology: Surface Mount; PartNumber: 10AS066N3F40E2SGE2; PackageDescription: 1517-Pin FineLine Ball-Grid Array (FBGA), Body 40 x 40 mm, Pitch 1 mm; ComponentLink2URL: https://www.altera.com/content/dam/altera-www/global/en_US/pdfs/literature/hb/arria-10/a10_datasheet.pdf; ComponentLink1URL: https://www.altera.com/; DatasheetVersion: Rev. 2016-06-24, 06/2016; ComponentLink1Description: Manufacturer URL

## Sheet HPS_Arria10.SchDoc: HPS Shared IOs
size B; DocumentNumber: 25; SheetNumber: 25; SheetTotal: 46
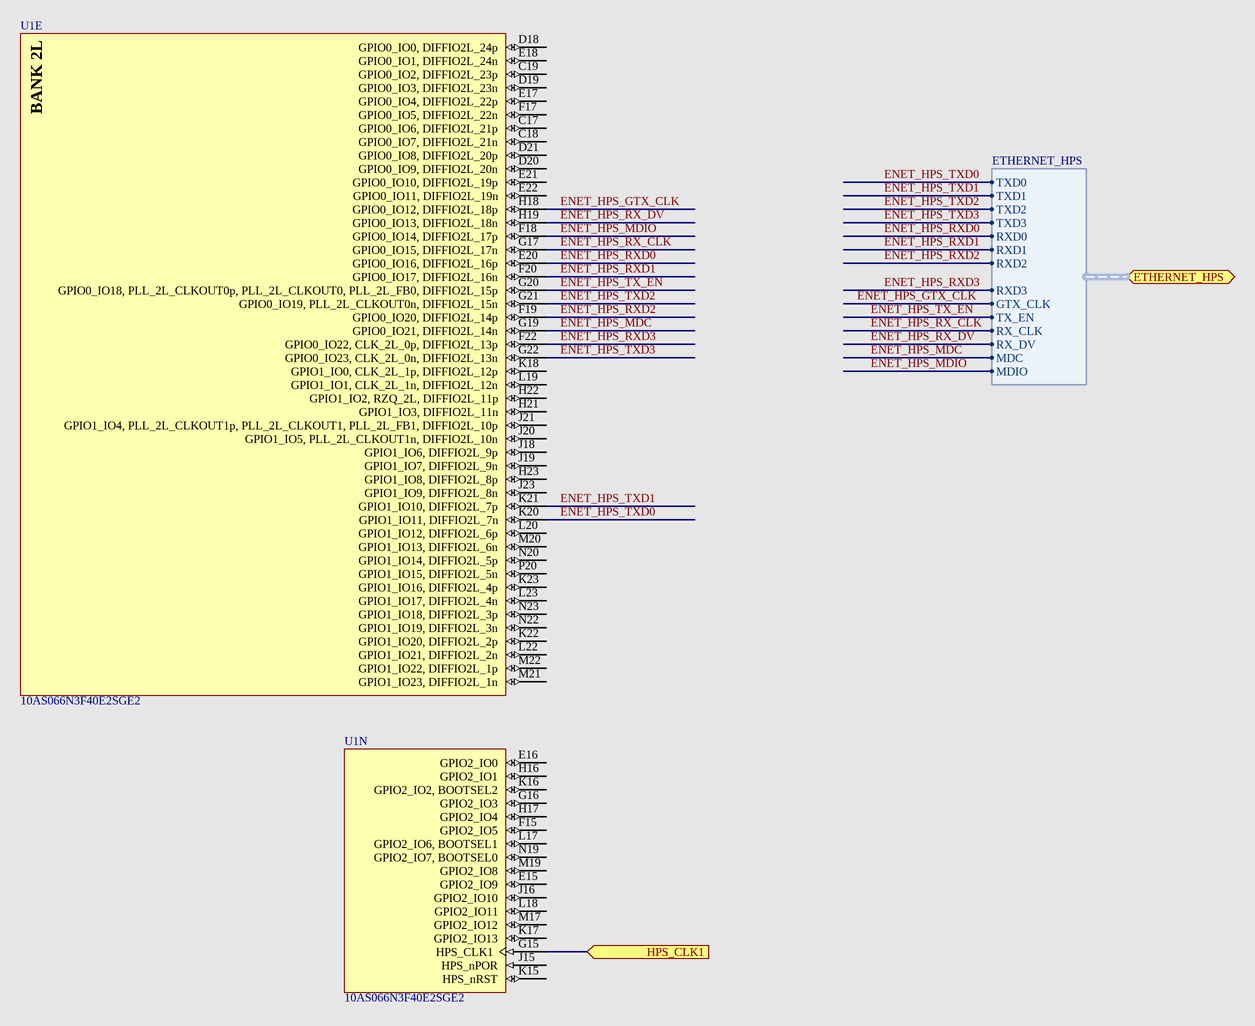
[diagram p15: HPS_Arria10.SchDoc]

### Parts
U1  10AS066N3F40E2SGE2  [ALTR-FBGA1517_A-350]  (parts E,N of 31)

### Ports
ETHERNET_HPS (harness ETHERNET_HPS), HPS_CLK1 (in)

### Harnesses
ETHERNET_HPS: RXD2, RXD1, RXD0, TXD3, TXD2, TXD1, TXD0, RXD3, GTX_CLK, TX_EN, RX_DV, RX_CLK, MDC, MDIO

### Nets
ENET_HPS_GTX_CLK: U1.H18(GPIO0_IO12,_DIFFIO2L_18p) ; port ETHERNET_HPS.GTX_CLK
ENET_HPS_MDC: U1.G19(GPIO0_IO21,_DIFFIO2L_14n) ; port ETHERNET_HPS.MDC
ENET_HPS_MDIO: U1.F18(GPIO0_IO14,_DIFFIO2L_17p) ; port ETHERNET_HPS.MDIO
ENET_HPS_RX_CLK: U1.G17(GPIO0_IO15,_DIFFIO2L_17n) ; port ETHERNET_HPS.RX_CLK
ENET_HPS_RX_DV: U1.H19(GPIO0_IO13,_DIFFIO2L_18n) ; port ETHERNET_HPS.RX_DV
ENET_HPS_RXD0: U1.E20(GPIO0_IO16,_DIFFIO2L_16p) ; port ETHERNET_HPS.RXD0
ENET_HPS_RXD1: U1.F20(GPIO0_IO17,_DIFFIO2L_16n) ; port ETHERNET_HPS.RXD1
ENET_HPS_RXD2: U1.F19(GPIO0_IO20,_DIFFIO2L_14p) ; port ETHERNET_HPS.RXD2
ENET_HPS_RXD3: U1.F22(GPIO0_IO22,_CLK_2L_0p,_DIFFIO2L_13p) ; port ETHERNET_HPS.RXD3
ENET_HPS_TX_EN: U1.G20(GPIO0_IO18,_PLL_2L_CLKOUT0p,_PLL_2L_CLKOUT0,_PLL_2L_FB0,_DIFFIO2L_15p) ; port ETHERNET_HPS.TX_EN
ENET_HPS_TXD0: U1.K20(GPIO1_IO11,_DIFFIO2L_7n) ; port ETHERNET_HPS.TXD0
ENET_HPS_TXD1: U1.K21(GPIO1_IO10,_DIFFIO2L_7p) ; port ETHERNET_HPS.TXD1
ENET_HPS_TXD2: U1.G21(GPIO0_IO19,_PLL_2L_CLKOUT0n,_DIFFIO2L_15n) ; port ETHERNET_HPS.TXD2
ENET_HPS_TXD3: U1.G22(GPIO0_IO23,_CLK_2L_0n,_DIFFIO2L_13n) ; port ETHERNET_HPS.TXD3
HPS_CLK1: U1.G15(HPS_CLK1) ; port HPS_CLK1

Not connected (* = marked no-connect by the designer): U1 C17(GPIO0_IO6,_DIFFIO2L_21p) C18(GPIO0_IO7,_DIFFIO2L_21n) C19(GPIO0_IO2,_DIFFIO2L_23p) D18(GPIO0_IO0,_DIFFIO2L_24p) D19(GPIO0_IO3,_DIFFIO2L_23n) D20(GPIO0_IO9,_DIFFIO2L_20n) D21(GPIO0_IO8,_DIFFIO2L_20p) E15(GPIO2_IO9) E16(GPIO2_IO0) E17(GPIO0_IO4,_DIFFIO2L_22p) E18(GPIO0_IO1,_DIFFIO2L_24n) E21(GPIO0_IO10,_DIFFIO2L_19p) E22(GPIO0_IO11,_DIFFIO2L_19n) F15(GPIO2_IO5) F17(GPIO0_IO5,_DIFFIO2L_22n) G16(GPIO2_IO3) H16(GPIO2_IO1) H17(GPIO2_IO4) H21(GPIO1_IO3,_DIFFIO2L_11n) H22(GPIO1_IO2,_RZQ_2L,_DIFFIO2L_11p) H23(GPIO1_IO8,_DIFFIO2L_8p) J15(HPS_nPOR) J16(GPIO2_IO10) J18(GPIO1_IO6,_DIFFIO2L_9p) J19(GPIO1_IO7,_DIFFIO2L_9n) J20(GPIO1_IO5,_PLL_2L_CLKOUT1n,_DIFFIO2L_10n) J21(GPIO1_IO4,_PLL_2L_CLKOUT1p,_PLL_2L_CLKOUT1,_PLL_2L_FB1,_DIFFIO2L_10p) J23(GPIO1_IO9,_DIFFIO2L_8n) K15(HPS_nRST) K16(GPIO2_IO2,_BOOTSEL2) K17(GPIO2_IO13) K18(GPIO1_IO0,_CLK_2L_1p,_DIFFIO2L_12p) K22(GPIO1_IO20,_DIFFIO2L_2p) K23(GPIO1_IO16,_DIFFIO2L_4p) L17(GPIO2_IO6,_BOOTSEL1) L18(GPIO2_IO11) L19(GPIO1_IO1,_CLK_2L_1n,_DIFFIO2L_12n) L20(GPIO1_IO12,_DIFFIO2L_6p) L22(GPIO1_IO21,_DIFFIO2L_2n) L23(GPIO1_IO17,_DIFFIO2L_4n) M17(GPIO2_IO12) M19(GPIO2_IO8) M20(GPIO1_IO13,_DIFFIO2L_6n) M21(GPIO1_IO23,_DIFFIO2L_1n) M22(GPIO1_IO22,_DIFFIO2L_1p) N19(GPIO2_IO7,_BOOTSEL0) N20(GPIO1_IO14,_DIFFIO2L_5p) N22(GPIO1_IO19,_DIFFIO2L_3n) N23(GPIO1_IO18,_DIFFIO2L_3p) P20(GPIO1_IO15,_DIFFIO2L_5n)

### Notes on the sheet
- Title
- Size:
- Date:
- B
- Number:
- Time:
- Revision:
- Sheet
- of
- File:
- (in symbol CMP-1689-00006-3, part E) BANK 2L

### Library data of the parts
U1 = CMP-1689-00006-3: as U1 on sheet DDR4_Arria10; ComponentLink3Description: Package Specification; PackageVersion: Rev. 5.0, 01/2016; ComponentLink3URL: https://www.altera.com/content/dam/altera-www/global/en_US/pdfs/literature/packaging/04r00461-04.pdf; ComponentLink2Description: Datasheet; Code_JEDEC: MS-034; Mounting Technology: Surface Mount; PartNumber: 10AS066N3F40E2SGE2; PackageDescription: 1517-Pin FineLine Ball-Grid Array (FBGA), Body 40 x 40 mm, Pitch 1 mm; ComponentLink2URL: https://www.altera.com/content/dam/altera-www/global/en_US/pdfs/literature/hb/arria-10/a10_datasheet.pdf; ComponentLink1URL: https://www.altera.com/; DatasheetVersion: Rev. 2016-06-24, 06/2016; ComponentLink1Description: Manufacturer URL

## Sheet DP&SDI_Arria10.SchDoc: DP & SDI
size B; DocumentNumber: 22; SheetNumber: 22; SheetTotal: 46
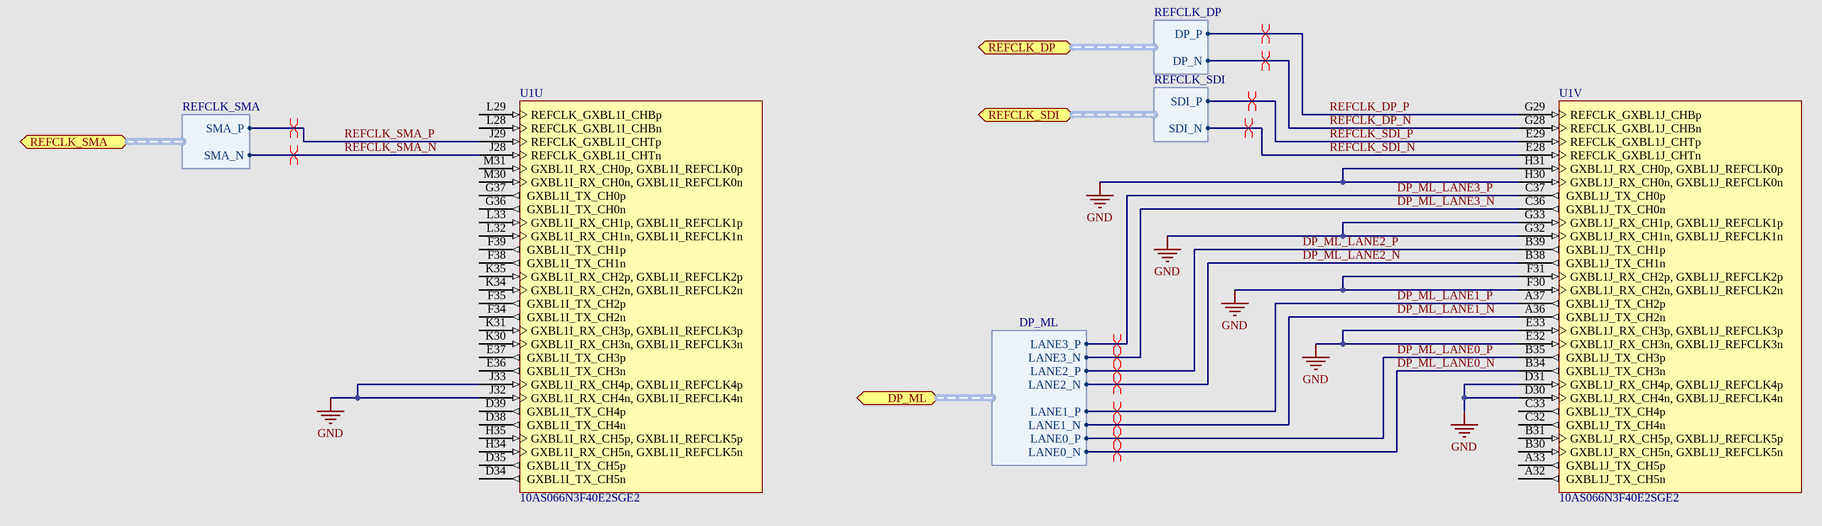
[diagram p16: DP&SDI_Arria10.SchDoc]

### Parts
U1  10AS066N3F40E2SGE2  [ALTR-FBGA1517_A-350]  (parts U,V of 31)

### Ports
DP_ML (harness DP_ML), REFCLK_DP (harness REFCLK_DP), REFCLK_SDI (harness REFCLK_SDI), REFCLK_SMA (harness REFCLK_SMA)

### Harnesses
REFCLK_SMA: SMA_P, SMA_N
REFCLK_DP: DP_P, DP_N
REFCLK_SDI: SDI_P, SDI_N
DP_ML: LANE2_N, LANE2_P, LANE3_N, LANE3_P, LANE1_P, LANE1_N, LANE0_P, LANE0_N

### Nets
GND: U1.D30(GXBL1J_RX_CH4n,_GXBL1J_REFCLK4n) U1.D31(GXBL1J_RX_CH4p,_GXBL1J_REFCLK4p) U1.E32(GXBL1J_RX_CH3n,_GXBL1J_REFCLK3n) U1.E33(GXBL1J_RX_CH3p,_GXBL1J_REFCLK3p) U1.F30(GXBL1J_RX_CH2n,_GXBL1J_REFCLK2n) U1.F31(GXBL1J_RX_CH2p,_GXBL1J_REFCLK2p) U1.G32(GXBL1J_RX_CH1n,_GXBL1J_REFCLK1n) U1.G33(GXBL1J_RX_CH1p,_GXBL1J_REFCLK1p) U1.H30(GXBL1J_RX_CH0n,_GXBL1J_REFCLK0n) U1.H31(GXBL1J_RX_CH0p,_GXBL1J_REFCLK0p) U1.J32(GXBL1I_RX_CH4n,_GXBL1I_REFCLK4n) U1.J33(GXBL1I_RX_CH4p,_GXBL1I_REFCLK4p)
DP_ML_LANE0_N: U1.B34(GXBL1J_TX_CH3n) ; port DP_ML.LANE0_N
DP_ML_LANE0_P: U1.B35(GXBL1J_TX_CH3p) ; port DP_ML.LANE0_P
DP_ML_LANE1_N: U1.A36(GXBL1J_TX_CH2n) ; port DP_ML.LANE1_N
DP_ML_LANE1_P: U1.A37(GXBL1J_TX_CH2p) ; port DP_ML.LANE1_P
DP_ML_LANE2_N: U1.B38(GXBL1J_TX_CH1n) ; port DP_ML.LANE2_N
DP_ML_LANE2_P: U1.B39(GXBL1J_TX_CH1p) ; port DP_ML.LANE2_P
DP_ML_LANE3_N: U1.C36(GXBL1J_TX_CH0n) ; port DP_ML.LANE3_N
DP_ML_LANE3_P: U1.C37(GXBL1J_TX_CH0p) ; port DP_ML.LANE3_P
REFCLK_DP_N: U1.G28(REFCLK_GXBL1J_CHBn) ; port REFCLK_DP.DP_N
REFCLK_DP_P: U1.G29(REFCLK_GXBL1J_CHBp) ; port REFCLK_DP.DP_P
REFCLK_SDI_N: U1.E28(REFCLK_GXBL1J_CHTn) ; port REFCLK_SDI.SDI_N
REFCLK_SDI_P: U1.E29(REFCLK_GXBL1J_CHTp) ; port REFCLK_SDI.SDI_P
REFCLK_SMA_N: U1.J28(REFCLK_GXBL1I_CHTn) ; port REFCLK_SMA.SMA_N
REFCLK_SMA_P: U1.J29(REFCLK_GXBL1I_CHTp) ; port REFCLK_SMA.SMA_P

Not connected (* = marked no-connect by the designer): U1 A32(GXBL1J_TX_CH5n) A33(GXBL1J_TX_CH5p) B30(GXBL1J_RX_CH5n,_GXBL1J_REFCLK5n) B31(GXBL1J_RX_CH5p,_GXBL1J_REFCLK5p) C32(GXBL1J_TX_CH4n) C33(GXBL1J_TX_CH4p) D34(GXBL1I_TX_CH5n) D35(GXBL1I_TX_CH5p) D38(GXBL1I_TX_CH4n) D39(GXBL1I_TX_CH4p) E36(GXBL1I_TX_CH3n) E37(GXBL1I_TX_CH3p) F34(GXBL1I_TX_CH2n) F35(GXBL1I_TX_CH2p) F38(GXBL1I_TX_CH1n) F39(GXBL1I_TX_CH1p) G36(GXBL1I_TX_CH0n) G37(GXBL1I_TX_CH0p) H34(GXBL1I_RX_CH5n,_GXBL1I_REFCLK5n) H35(GXBL1I_RX_CH5p,_GXBL1I_REFCLK5p) K30(GXBL1I_RX_CH3n,_GXBL1I_REFCLK3n) K31(GXBL1I_RX_CH3p,_GXBL1I_REFCLK3p) K34(GXBL1I_RX_CH2n,_GXBL1I_REFCLK2n) K35(GXBL1I_RX_CH2p,_GXBL1I_REFCLK2p) L28(REFCLK_GXBL1I_CHBn) L29(REFCLK_GXBL1I_CHBp) L32(GXBL1I_RX_CH1n,_GXBL1I_REFCLK1n) L33(GXBL1I_RX_CH1p,_GXBL1I_REFCLK1p) M30(GXBL1I_RX_CH0n,_GXBL1I_REFCLK0n) M31(GXBL1I_RX_CH0p,_GXBL1I_REFCLK0p)

### Layout directives
differential pair: DP_ML_LANE0_N, DP_ML_LANE0_P, DP_ML_LANE1_N, DP_ML_LANE1_P, DP_ML_LANE2_N, DP_ML_LANE2_P, DP_ML_LANE3_N, DP_ML_LANE3_P, REFCLK_DP_N, REFCLK_DP_P, REFCLK_SDI_N, REFCLK_SDI_P, REFCLK_SMA_N, REFCLK_SMA_P

### Notes on the sheet
- Title
- Size:
- Date:
- B
- Number:
- Time:
- Revision:
- Sheet
- of
- File:

### Library data of the parts
U1 = CMP-1689-00006-3: as U1 on sheet DDR4_Arria10; ComponentLink3Description: Package Specification; PackageVersion: Rev. 5.0, 01/2016; ComponentLink3URL: https://www.altera.com/content/dam/altera-www/global/en_US/pdfs/literature/packaging/04r00461-04.pdf; ComponentLink2Description: Datasheet; Code_JEDEC: MS-034; Mounting Technology: Surface Mount; PartNumber: 10AS066N3F40E2SGE2; PackageDescription: 1517-Pin FineLine Ball-Grid Array (FBGA), Body 40 x 40 mm, Pitch 1 mm; ComponentLink2URL: https://www.altera.com/content/dam/altera-www/global/en_US/pdfs/literature/hb/arria-10/a10_datasheet.pdf; ComponentLink1URL: https://www.altera.com/; DatasheetVersion: Rev. 2016-06-24, 06/2016; ComponentLink1Description: Manufacturer URL